# Altium project GRIPPER2009.PrjPcb (part 1 of 2)
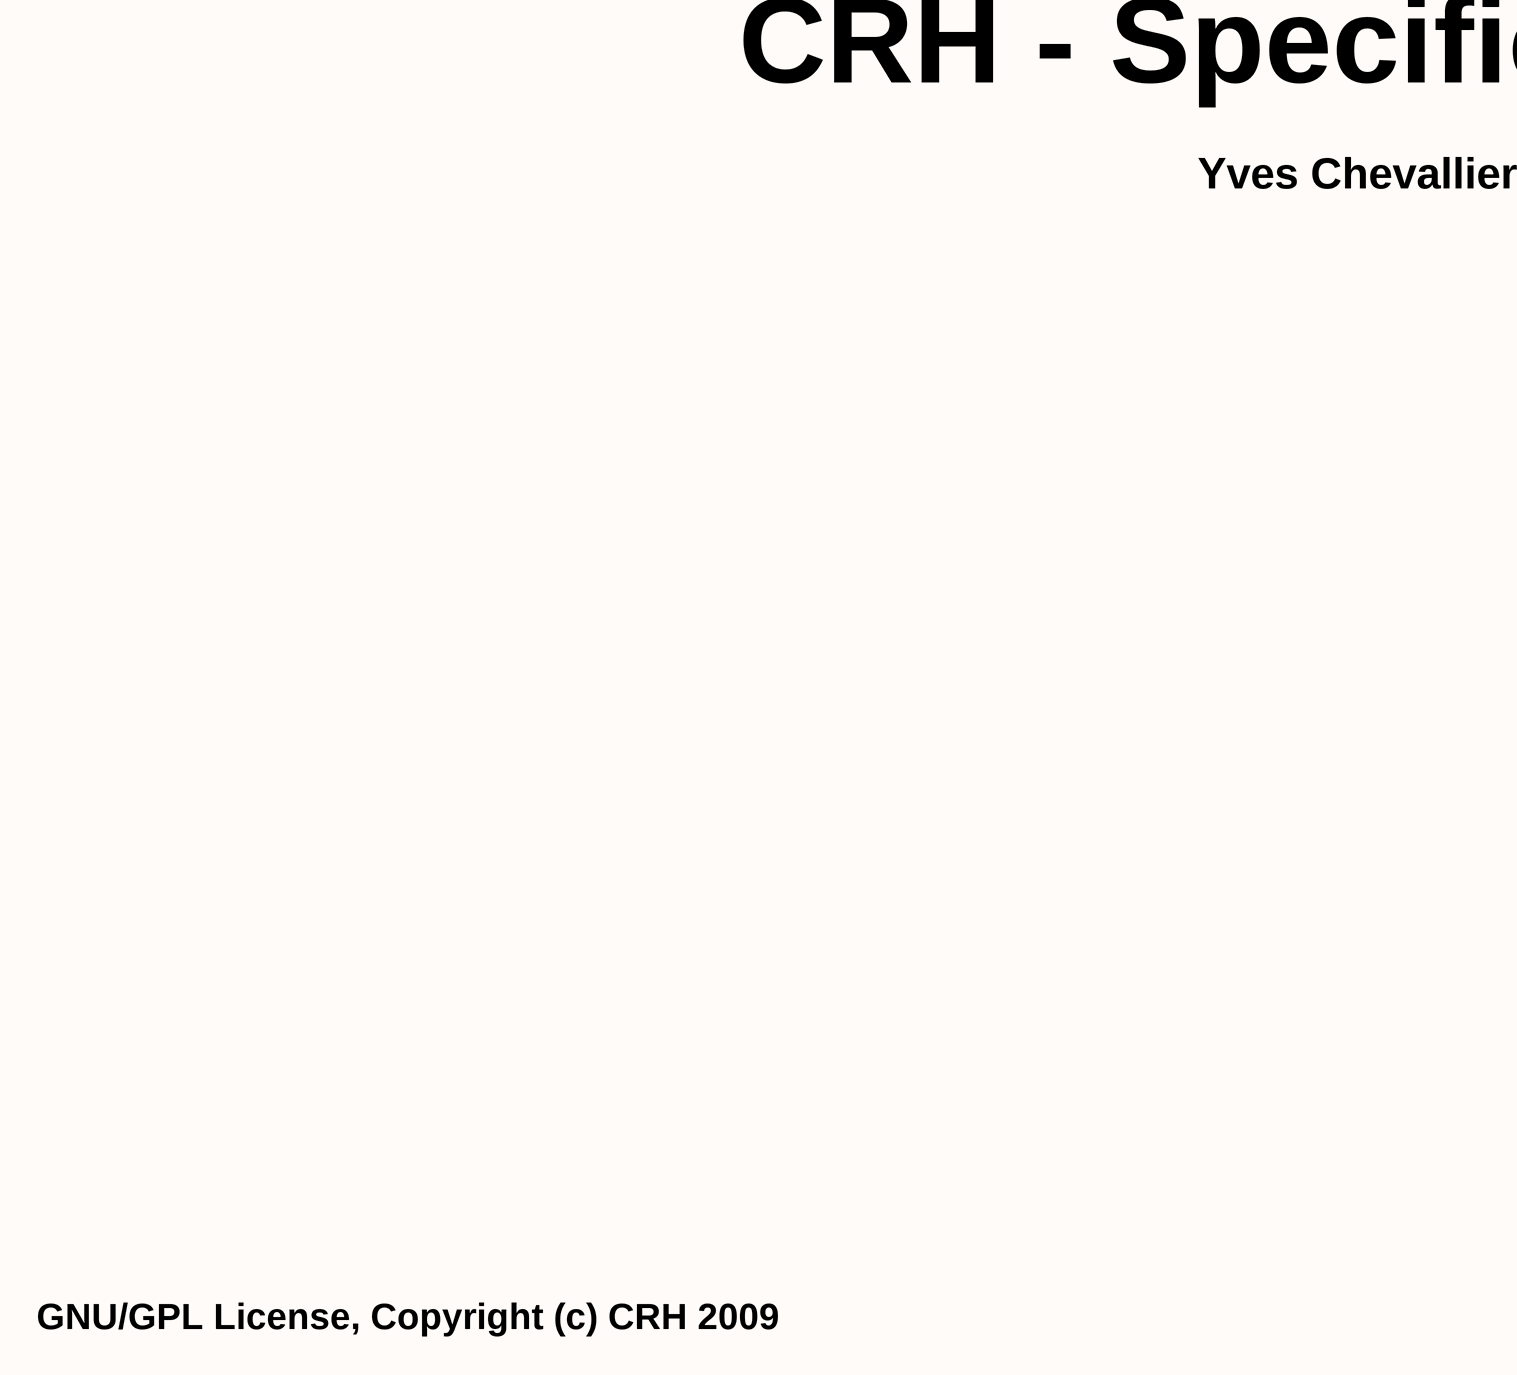
[diagram p0: 1.SchDoc, left]
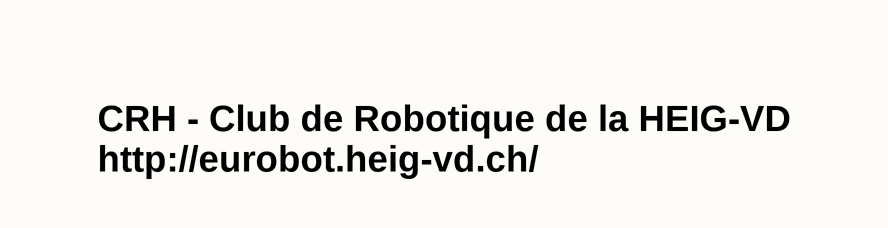
[diagram p1: 1.SchDoc, right]
5 sheets, 266 parts. Net scope: hierarchical (ports join the sheet entries above them; power ports are global).
Board file: GRIPPER2009.PcbDoc
Sheets:
  1.SchDoc
  2.SchDoc
  3.SchDoc
    TWO MOTORS = 5.SchDoc
      DRIVE1 = 4.SchDoc
      DRIVE = 4.SchDoc
    TWO MOTORS1 = 5.SchDoc
      DRIVE1 = 4.SchDoc
      DRIVE = 4.SchDoc

## Sheet 1.SchDoc
size 594 x 420 mm

### Notes on the sheet
- CRH - Specific board 2009
- Yves Chevallier - 31 Janvier 2009
- CRH - Club de Robotique de la HEIG-VD
  http://eurobot.heig-vd.ch/
- GNU/GPL License, Copyright (c) CRH 2009

## Sheet 2.SchDoc
size 420 x 297 mm
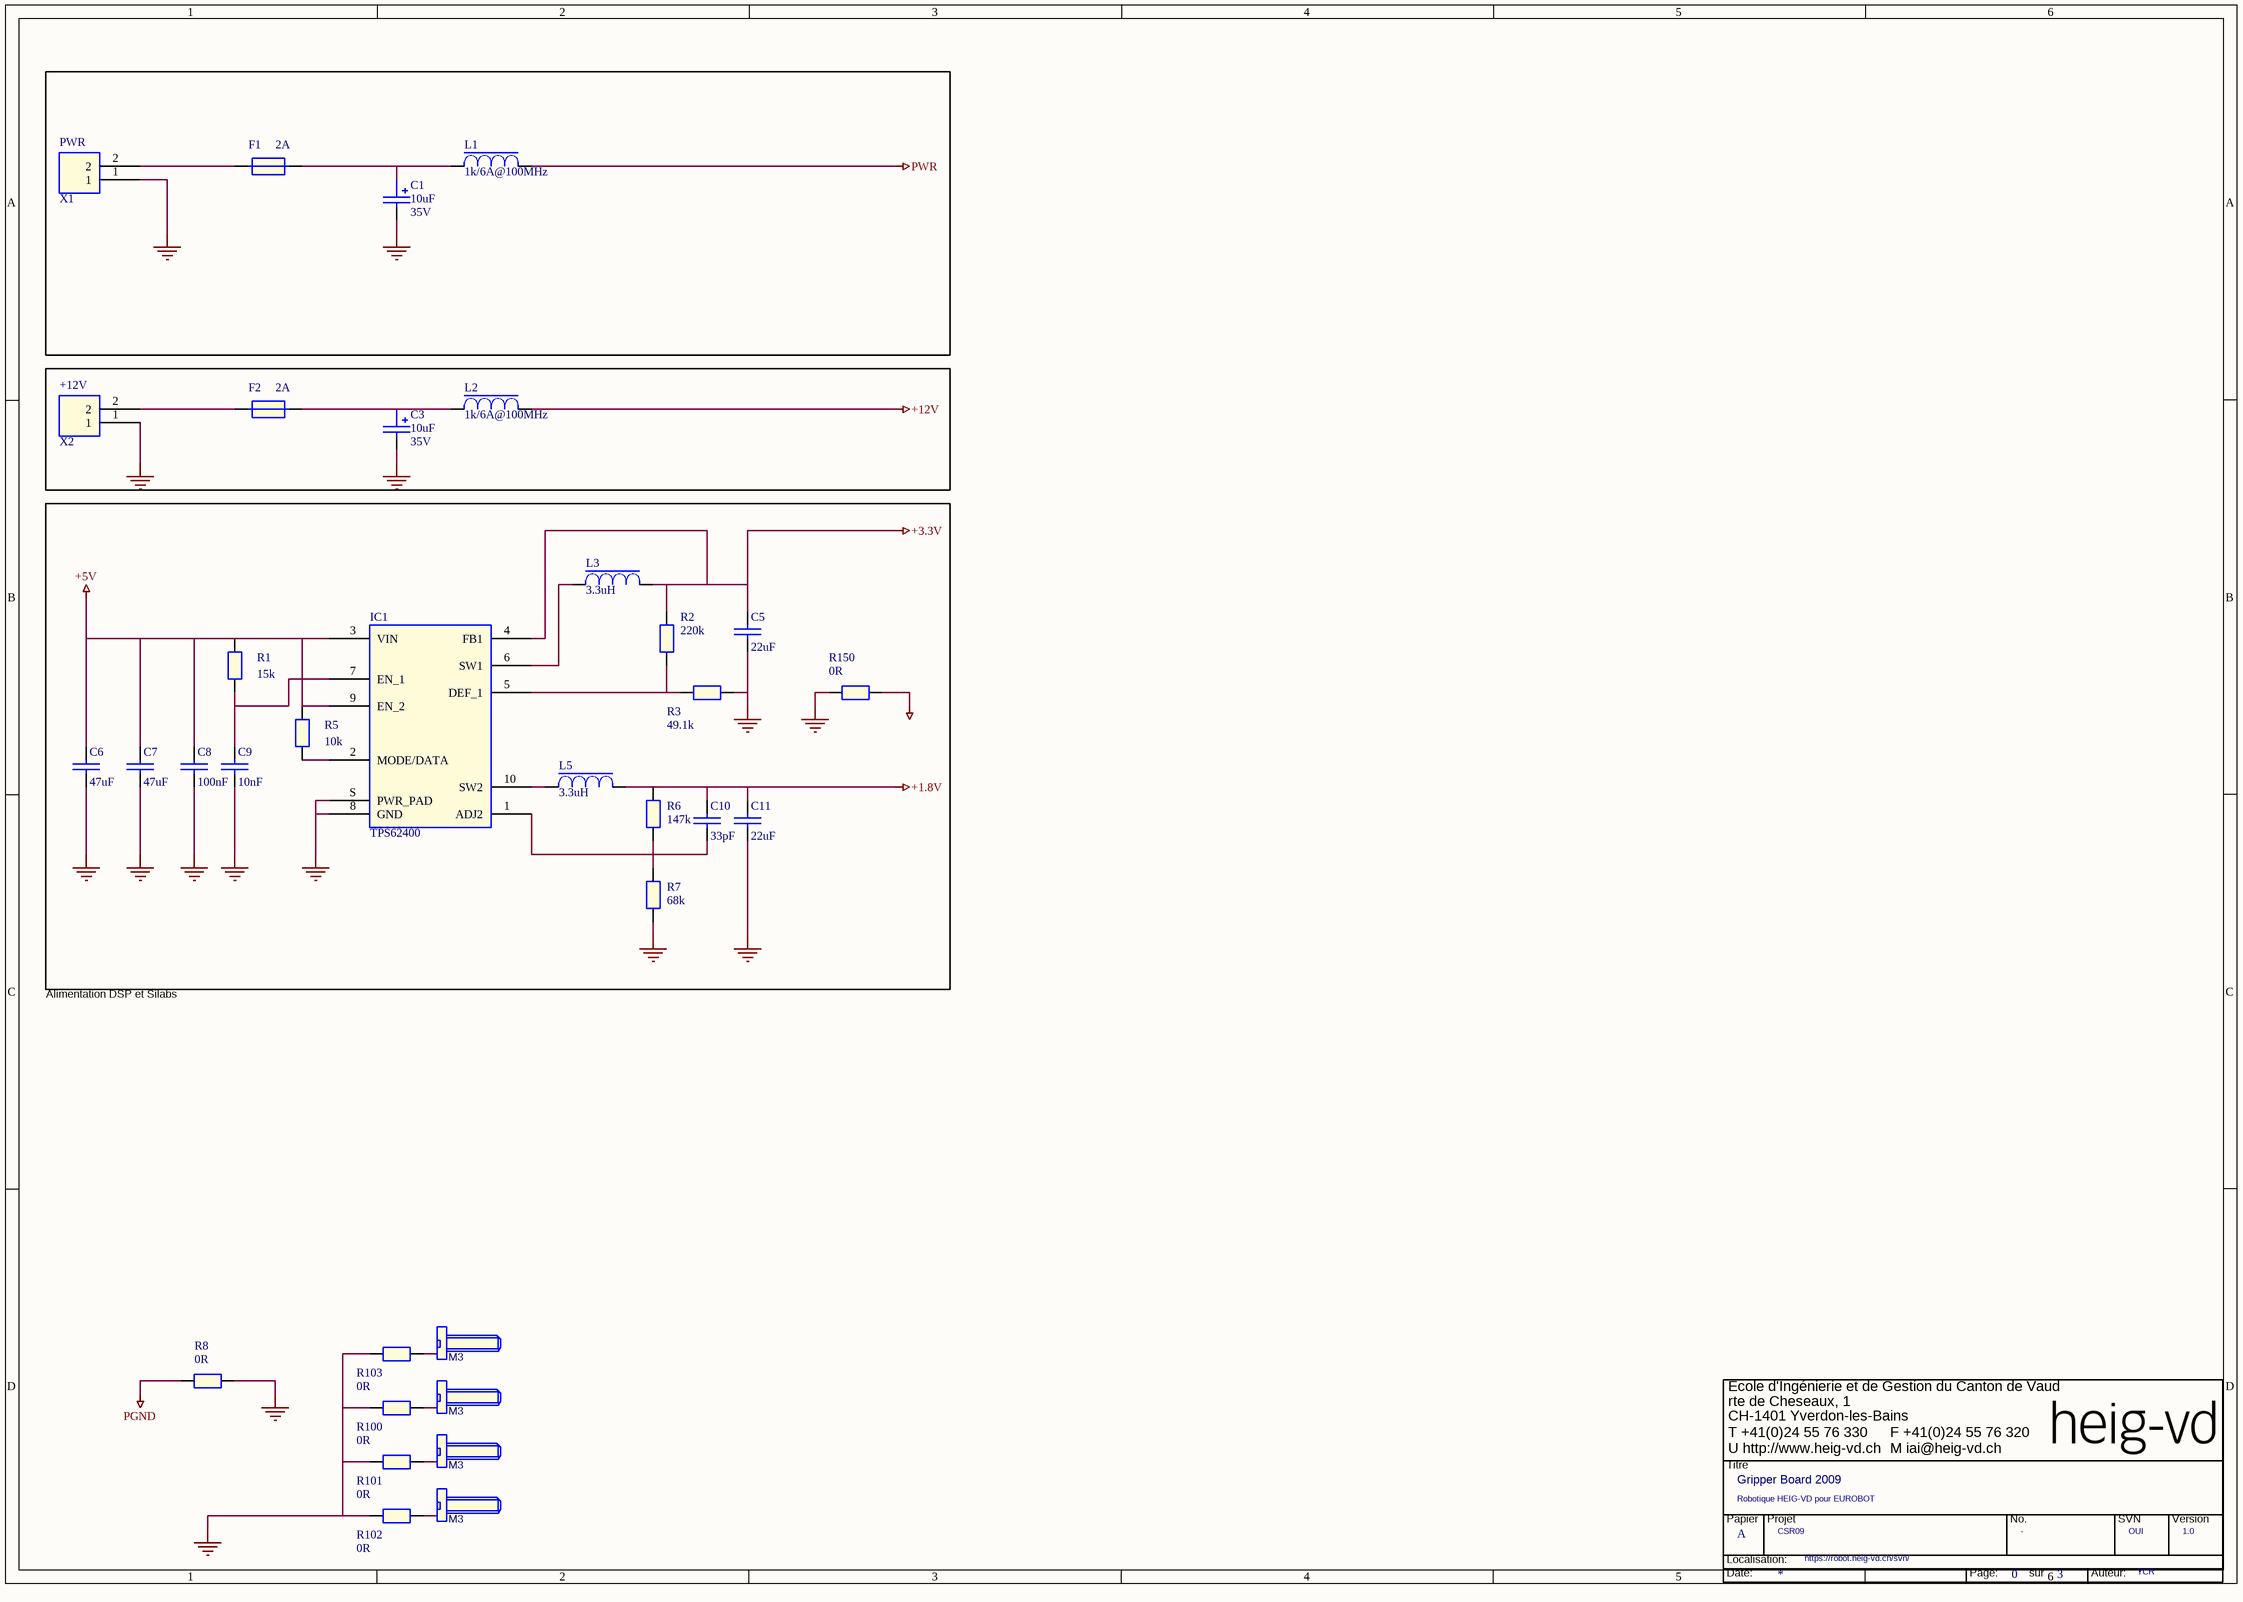
[diagram p2: 2.SchDoc]

### Parts
(Parts that share a designator on the sheet are numbered #1, #2 ... from top to bottom, then left to right.)
*#1  RevCode: 1.0  Title: Gripper Board 2009  Page Size: A  Page Number: 0  Page Count: 3  Projet: CSR09  Subtitle: Robotique HEIG-VD pour EUROBOT  Author: YCR  SVN: OUI  (hidden comment: TitleBlock HEIG-VD)  (graphical)
C1  10uF  Voltage: 35V  [SM/C_0805]
C3  10uF  Voltage: 35V  [SM/C_0805]
C5  22uF  [SM/C_0805]
C6  47uF  [SM/C_0805]
C7  47uF  [SM/C_0805]
C8  100nF  [SM/C_0805]
C9  10nF  [SM/C_0805]
C10  33pF  [SM/C_0805]
C11  22uF  [SM/C_0805]
F1  2A  [HEIG/LITTLEFUSE/NANO2]
F2  2A  [HEIG/LITTLEFUSE/NANO2]
H1  M3  [M3]  (value not drawn)
H2  M3  [M3]  (value not drawn)
H3  M3  [M3]  (value not drawn)
H4  M3  [M3]  (value not drawn)
IC1  TPS62400  [HEIG/TI/S-PVSON-N10]
L1  1k/6A@100MHz  [HEIG/SM/L_1210]
L2  1k/6A@100MHz  [HEIG/SM/L_1210]
L3  3.3uH  [HEIG/COILS/VLF4012A]
L5  3.3uH  [HEIG/COILS/VLF4012A]
R1  15k  [SM/R_0805]
R2  220k  [SM/R_0805]
R3  49.1k  [SM/R_0805]
R5  10k  [SM/R_0805]
R6  147k  [SM/R_0805]
R7  68k  [SM/R_0805]
R8  0R  [R400]
R100  0R  [SM/R_0805]
R101  0R  [SM/R_0805]
R102  0R  [SM/R_0805]
R103  0R  [SM/R_0805]
R150  0R  [SM/R_0805]
X1  PWR  [HEIG/PHOENIX/MC 1,5/ 2-G-3,81]
X2  +12V  [HEIG/PHOENIX/MC 1,5/ 2-G-3,81]

### Nets
+1.8V: C10.1 C11.1 L5.2 R6.2
+3.3V: C5.1 IC1.4(FB1) L3.2 R2.2
+5V: C6.1 C7.1 C8.1 IC1.3(VIN) IC1.9(EN_2) R1.2 R5.2
+12V: L2.2
AGND: R150.2
GND: C1.2 C3.2 C5.2 C6.2 C7.2 C8.2 C9.2 C11.2 IC1.8(GND) IC1.S(PWR_PAD) R3.2 R7.1 R8.2 R100.1 R101.1 R102.1 R103.1 R150.1 X1.1 X2.1
PGND: R8.1
PWR: L1.2
NetC1_1: C1.1 F1.2 L1.1
NetC3_1: C3.1 F2.2 L2.1
NetC9_1: C9.1 IC1.7(EN_1) R1.1
NetC10_2: C10.2 IC1.1(ADJ2) R6.1 R7.2
NetF1_1: F1.1 X1.2
NetF2_1: F2.1 X2.2
NetH1_1: H1.1(EARTH) R103.2
NetH2_1: H2.1(EARTH) R100.2
NetH3_1: H3.1(EARTH) R101.2
NetH4_1: H4.1(EARTH) R102.2
NetIC1_2: IC1.2(MODE/DATA) R5.1
NetIC1_5: IC1.5(DEF_1) R2.1 R3.1
NetIC1_6: IC1.6(SW1) L3.1
NetIC1_10: IC1.10(SW2) L5.1

### Notes on the sheet
- Alimentation DSP et Silabs
- (in symbol TitleBlock HEIG-VD) Ecole d'Ingénierie et de Gestion du Canton de Vaud; rte de Cheseaux, 1; CH-1401 Yverdon-les-Bains; T +41(0)24 55 76 330; F +41(0)24 55 76 320; U http://www.heig-vd.ch; M iai@heig-vd.ch; Titre; Papier; Projet; No.; SVN; Version; Localisation:; Date:; Page:; sur; Auteur:

### Library data of the parts
*#1 = TitleBlock HEIG-VD: OrgName: Yves Chevallier; OrgAddr1: Ecole d'Ingenierie et du Canton de Vaud; OrgAddr2: route de Cheseaux, 1; OrgAddr3: 1400 Yverdon-les-Bains; Page Create Date: March  8, 1995; No Projet: -; Location: https://robot.heig-vd.ch/svn/; Page Modify Date: *
C1 = C+: PCB Footprint: HEIG/SM/CT_7343; Prix: 2.85; Ref. Fabricant: AVX TPSD106K035R0125; Quantité min: 1; Fabricant: AVX; Ref. Distributeur: 1135215; Distributeur: Farnell; REF DISTRIBUTEUR: Footprint?; Manufacturer: AVX
C3 = C+: Manufacturer: AVX; PCB Footprint: HEIG/SM/CT_7343; Quantité min: 1; Ref. Fabricant: AVX TPSD106K035R0125; Prix: 2.85; Fabricant: AVX; REF DISTRIBUTEUR: Footprint?; Distributeur: Farnell; Ref. Distributeur: 1135215
C5 = C_Dup1: Quantité min: 1; Fabricant: AVX; Ref. Fab: AVXMCCTA106M006.MULTICOMP; VOLTAGE: 6.3V; Référence: 757-720; Prix Unitaire: 0.40; Prix: 1.15; Ref. Fabricant: C1206C226K9PAC; PCB Footprint: HEIG/SM/C_1206; Price in €: 0.87; Ref. Distributor: 967-014; Distributor: Farnell; Ref. Distributeur: 1288265; Distributeur: Farnell
C6 C7 = C_Dup1: Quantité min: 1; Fabricant: AVX; Ref. Fabricant: 12106D476MAT2A; Prix: 8.20; Ref. Fab: AVXMCCTA106M006.MULTICOMP; VOLTAGE: 6.3V; Référence: 757-720; Prix Unitaire: 0.40; PCB Footprint: HEIG/SM/C_1206; Ref. Distributeur: 1327743; Distributeur: Farnell; Price in €: 0.87; Ref. Distributor: 967-014; Distributor: Farnell
C8-C10 = C_Dup1: PCB Footprint: HEIG/SM/C_0603; Quantité min: 1; Ref. Fab: AVXMCCTA106M006.MULTICOMP; VOLTAGE: 10V; Référence: 757-720; Prix Unitaire: 0.40; Distributeur: Farnell; Price in €: 0.87; Ref. Distributor: 967-014; Distributor: Farnell
C11 = C_Dup1: Quantité min: 1; Fabricant: AVX; Ref. Fabricant: C1206C226K9PAC; Prix: 1.15; Ref. Fab: AVXMCCTA106M006.MULTICOMP; VOLTAGE: 6.3V; Référence: 757-720; Prix Unitaire: 0.40; PCB Footprint: HEIG/SM/C_1206; Ref. Distributeur: 1288265; Distributeur: Farnell; Price in €: 0.87; Ref. Distributor: 967-014; Distributor: Farnell
F1 = Fusible: Fabricant: LITTELFUSE; Ref. Fabricant: 0461002T; Prix: 2.65; Voltage: 60V; Quantité min: 1; PCB Footprint: HEIG/LITTLEFUSE/NANO2; Ref. Distributeur: 1651770; Distributeur: Farnell
F2 = Fusible: Fabricant: LITTELFUSE; Ref. Fabricant: 0461002T; Prix: 2.65; Voltage: 600V; Quantité min: 1; PCB Footprint: HEIG/LITTLEFUSE/NANO2; Ref. Distributeur: 1651770; Distributeur: Farnell
H1-H4 = M3: PCB Footprint: HEIG/HOLE/M3
IC1 = TPS62400_1: Fabricant: TEXAS INSTRUMENTS; Ref. Fabricant: TPS62400DRCTG4; Prix: 11.25; Quantité min: 1; PCB Footprint: HEIG/TI/S-PVSON-N10; Ref. Distributeur: 1329597; Distributeur: Farnell
L1 L2 = L Noyau: Manufacturer: EPCOS; Prix: 0.51; Ref. Fabricant: FBMH3225HM102NT; Quantité min: 1; Fabricant: TAIYO YUDEN; Distributeur: Farnell; Ref. Distributeur: 1651731; REF DISTRIBUTEUR: Footprint?; PCB Footprint: HEIG/SM/L_1210
L3 L5 = L Noyau: Prix: 3.90; Ref. Fabricant: VLF4012AT-3R3M1R3; Fabricant: TDK; Quantité min: 1; Ref. Distributeur: 1301686; Distributeur: Farnell; PCB Footprint: HEIG/COILS/VLF4012A
R1 R2 R5 = R SMD 0805N: PCB Footprint: HEIG/SM/R_0603; Quantité min: 50; Prix: 0.064; Package: SMD 0805N; Distributeur: Farnell
R3 = R SMD 0805N: PCB Footprint: HEIG/SM/R_0603; Prix: 0.064; Quantité min: 50; Package: SMD 0805N; Distributeur: Farnell
R6 = R SMD 0805N: PCB Footprint: HEIG/SM/R_0603; Quantité min: 50; Fabricant: MULTICOMP; Ref. Fabricant: MC 0.063W 0603 1% 147K; Prix: 0.064; Package: SMD 0805N; Ref. Distributeur: 1171002; Distributeur: Farnell
R7 = R SMD 0805N: PCB Footprint: HEIG/SM/R_0603; Quantité min: 50; Fabricant: MULTICOMP; Ref. Fabricant: MC 0.063W 0603 5% 68K; Prix: 0.064; Package: SMD 0805N; Ref. Distributeur: 9332278; Distributeur: Farnell
R8 = R_Dup3: PCB Footprint: HEIG/SM/R_0805; Ref. Fabricant: MC 0.063W 0603 1% 10K; Prix: 0.06; Quantité min: 50; Fabricant: MULTICOMP; Ref. Distributeur: 9330399; Distributeur: Farnell
R100-R103 = R SMD 0805N: Prix: 0.064; Quantité min: 50; PCB Footprint: HEIG/SM/R_0805; Package: SMD 0805N; Distributeur: Farnell
R150 = R SMD 0805N: Prix: 0.064; Quantité min: 50; PCB Footprint: HEIG/SM/R_0603; Package: SMD 0805N; Distributeur: Farnell
X1 X2 = Connecteur 02: PCB Footprint: HEIG/PHOENIX/MC 1,5/ 2-G-3,81

## Sheet 3.SchDoc
size 420 x 297 mm
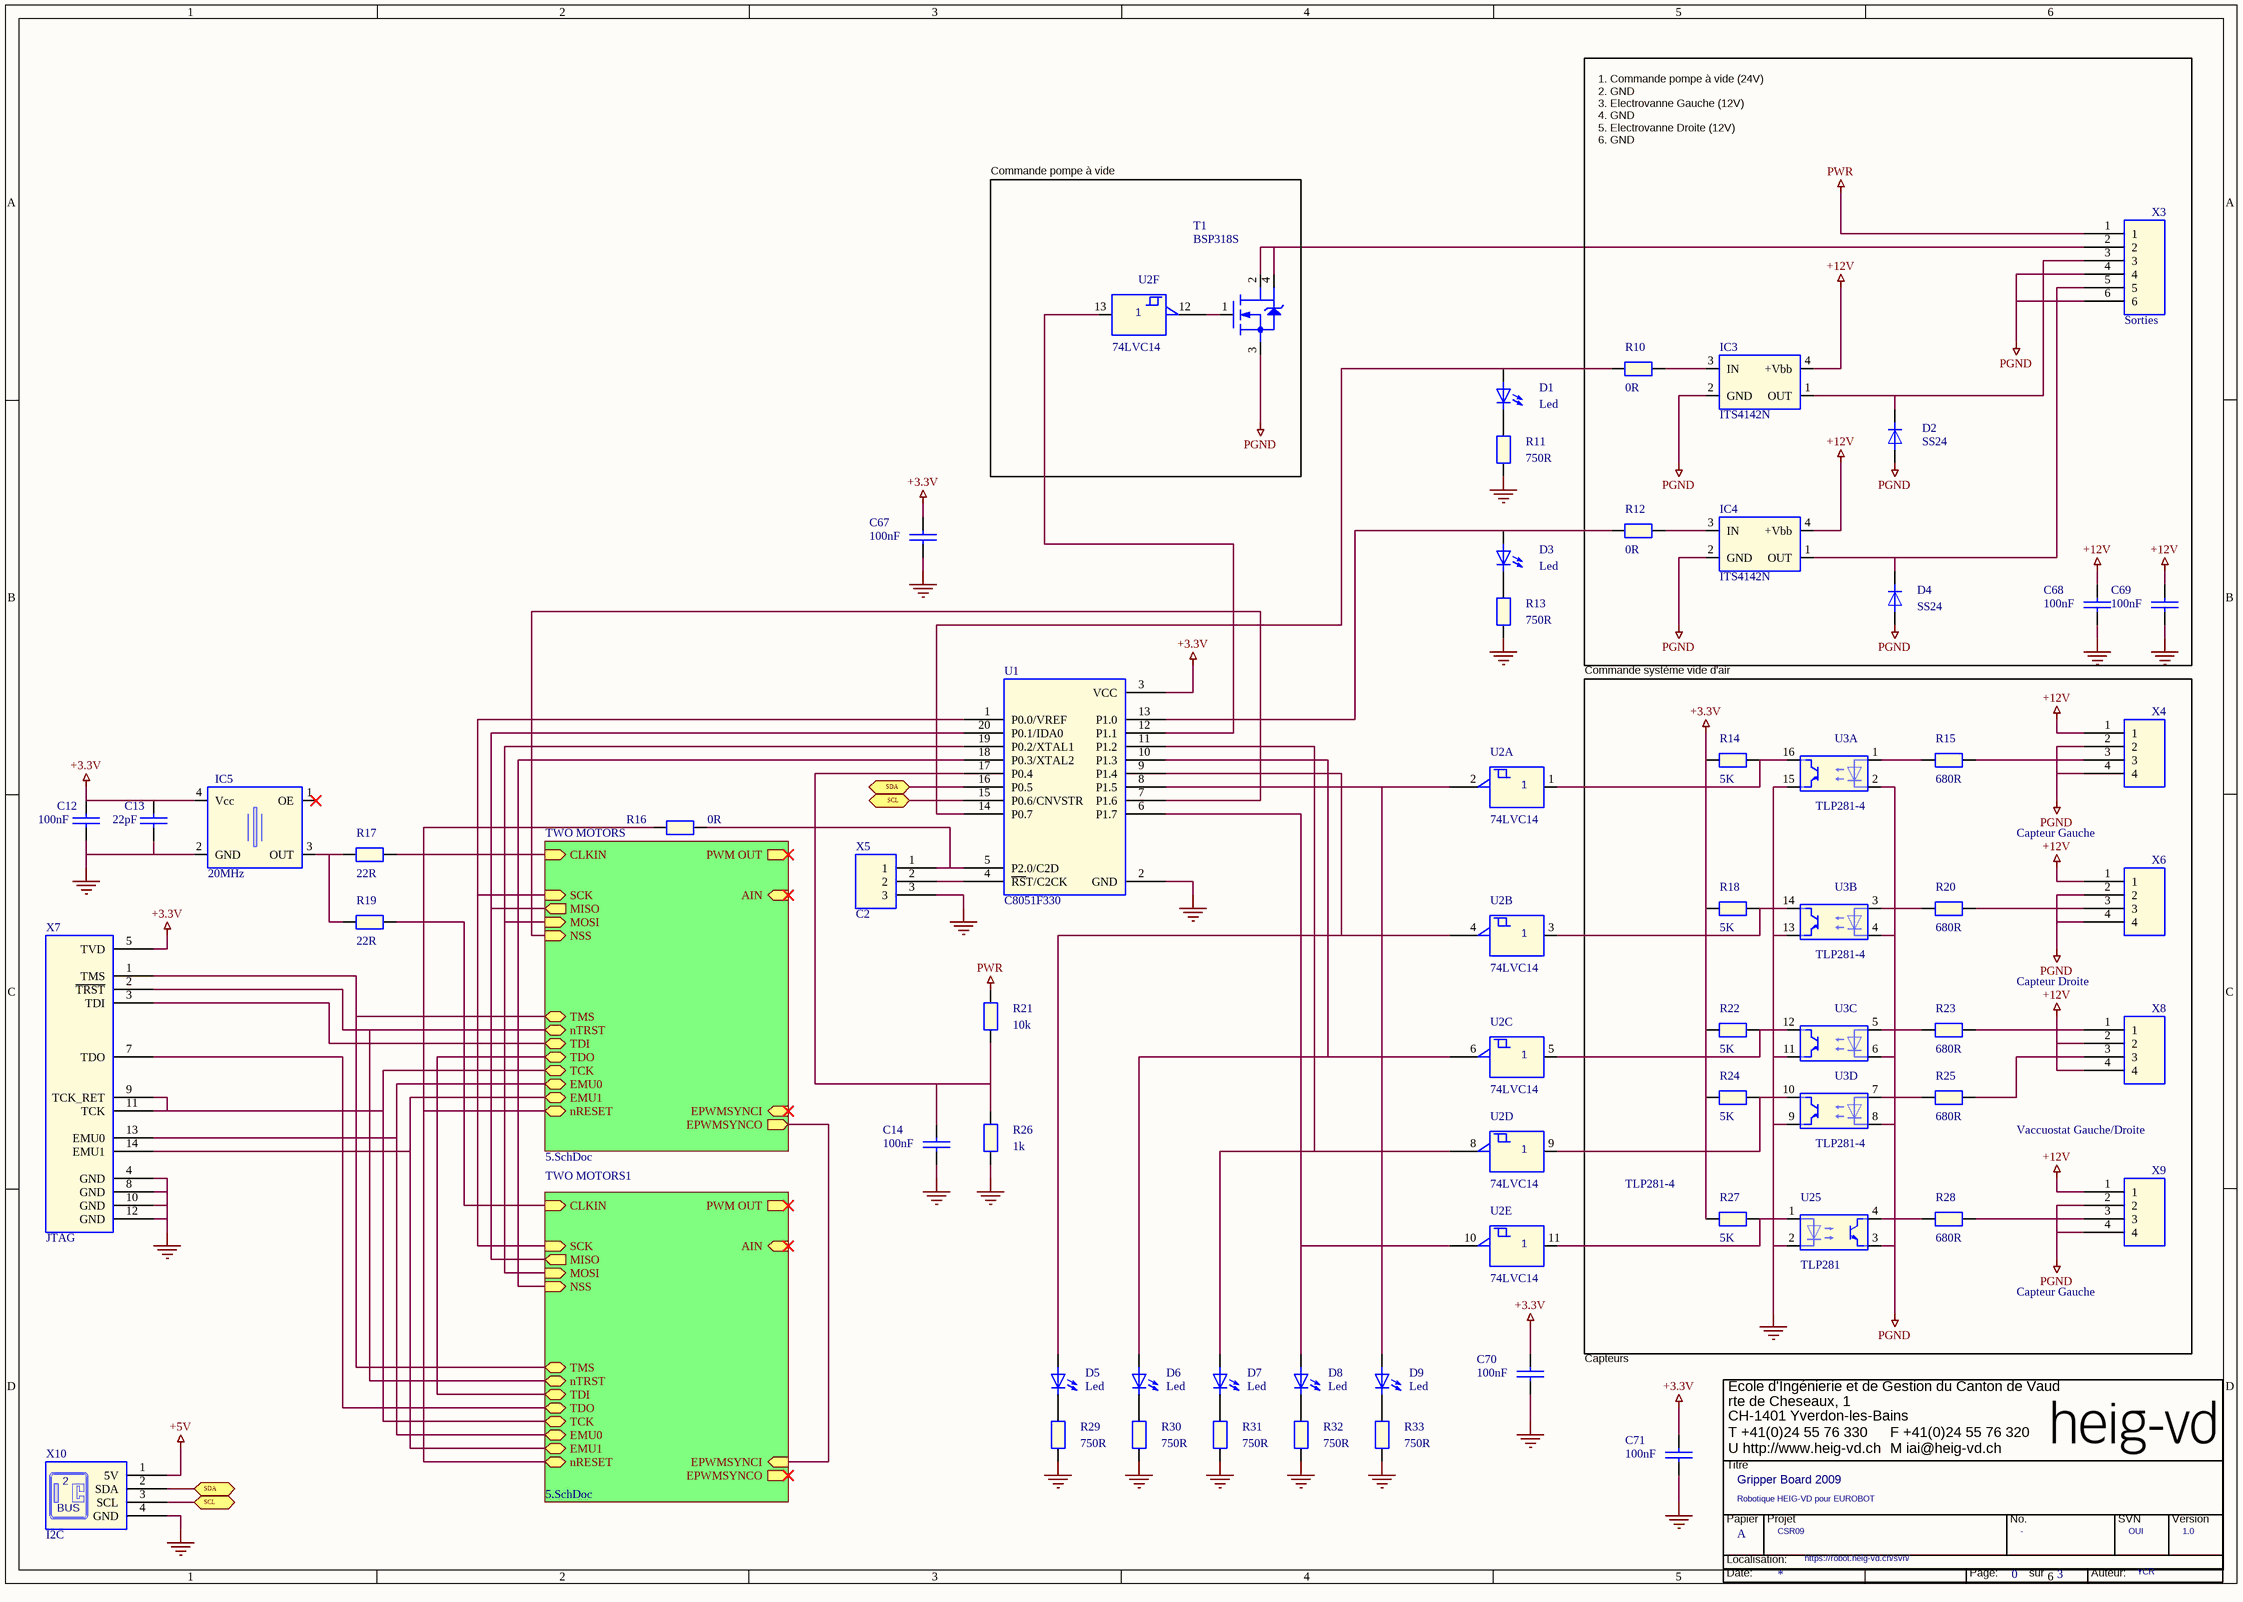
[diagram p3: 3.SchDoc]

### Parts
(Parts that share a designator on the sheet are numbered #1, #2 ... from top to bottom, then left to right.)
*#2  RevCode: 1.0  Title: Gripper Board 2009  Page Size: A  Page Number: 0  Page Count: 3  Projet: CSR09  Subtitle: Robotique HEIG-VD pour EUROBOT  Author: YCR  SVN: OUI  (hidden comment: TitleBlock HEIG-VD)  (graphical)
C12  100nF  [SM/C_0805]
C13  22pF  [SM/C_0805]
C14  100nF  [SM/C_0805]
C67  100nF  [SM/C_0805]
C68  100nF  [SM/C_0805]
C69  100nF  [SM/C_0805]
C70  100nF  [SM/C_0805]
C71  100nF  [SM/C_0805]
D1  Led  [LED 5]
D2  SS24  [HEIG/SM/DO214]
D3  Led  [LED 5]
D4  SS24  [HEIG/SM/DO214]
D5  Led  [LED 5]
D6  Led  [LED 5]
D7  Led  [LED 5]
D8  Led  [LED 5]
D9  Led  [LED 5]
IC3  ITS4142N  [HEIG/SM/SOT223]
IC4  ITS4142N  [HEIG/SM/SOT223]
IC5  20MHz  [HEIG/OSC/SPX0/SG-310]
R10  0R  [R400]
R11  750R  [R400]
R12  0R  [R400]
R13  750R  [R400]
R14  5K  [R400]
R15  680R  [R400]
R16  0R  [R400]
R17  22R  [R400]
R18  5K  [R400]
R19  22R  [R400]
R20  680R  [R400]
R21  10k  [R400]
R22  5K  [R400]
R23  680R  [R400]
R24  5K  [R400]
R25  680R  [R400]
R26  1k  [R400]
R27  5K  [R400]
R28  680R  [R400]
R29  750R  [R400]
R30  750R  [R400]
R31  750R  [R400]
R32  750R  [R400]
R33  750R  [R400]
T1  BSP318S  [HEIG/SM/SOT223]
U1  C8051F330  [F300]
U2#1  74LVC14  [HEIG/SM/SOIC14]  (part F of 6)
U2#2  74LVC14  [HEIG/SM/SOIC14]  (part A of 6)
U2#3  74LVC14  [HEIG/SM/SOIC14]  (part B of 6)
U2#4  74LVC14  [HEIG/SM/SOIC14]  (part C of 6)
U2#5  74LVC14  [HEIG/SM/SOIC14]  (part D of 6)
U2#6  74LVC14  [HEIG/SM/SOIC14]  (part E of 6)
U3  TLP281-4  [HEIG/SM/SOIC16/7.0M]  (parts A,B,C,D of 4)
U25  TLP281  [HEIG/SM/SOIC04/7.0M]
X3  Sorties  [HEIG/WAGO/733-336]
X4  Capteur Gauche  [HEIG/WAGO/733-334]
X5  C2  [HEIG/CON/INLINE03]
X6  Capteur Droite  [HEIG/WAGO/733-334]
X7  JTAG  [HEIG/CON/INLINE14/2]
X8  Vaccuostat Gauche/Droite  [HEIG/WAGO/733-334]
X9  Capteur Gauche  [HEIG/WAGO/733-334]
X10  I2C  [HEIG/CON/MICROMATCH/4F]

### Blocks framed on the sheet
Commande pompe à vide: T1 U2#1
Commande système vide d'air: R14 R15 R18 R20 R22-R25 R27 R28 U3 U25 X4 X6 X8 X9

### Sub-sheets
TWO MOTORS = 5.SchDoc: MOSI (in), NSS (in), SCK (in), MISO (out), TMS (bidir), nTRST (bidir), TDI (bidir), TDO (bidir), TCK (bidir), EMU0 (bidir), EMU1 (bidir), nRESET (bidir), CLKIN (in), EPWMSYNCO (out), EPWMSYNCI (in), AIN (in), PWM OUT (out)  | ReuseAnnotated: YES; U__2_PartReference: U22; R494_PartReference: R67; C__7_PartReference: C53; U__3_PartReference: IC8; WARNING1_PartReference: WARNING3; C__8_PartReference: C54; C__2_PartReference: C55; U__4_PartReference: IC8; U7_1_PartReference: U7; R__11_PartReference: R68; D__PartReference: D12; U24_PartReference: U7; C__18_PartReference: C56; C__PartReference: C57; Q__1_PartReference: Q3; C__1_PartReference: C58; DRIVE_X__PartReference: X15; DRIVE_C__15_PartReference: C47; DRIVE_U__9_PartReference: U19; DRIVE_C__13_PartReference: C48; DRIVE_C__16_PartReference: C49; DRIVE_R__10_PartReference: R87; DRIVE_C__17_PartReference: C51; DRIVE_C__20_PartReference: C77; DRIVE_R__6_PartReference: R62; DRIVE_R__9_PartReference: R86; DRIVE_U6_PartReference: U20; DRIVE_R__4_PartReference: R63; DRIVE_C__14_PartReference: C52; DRIVE_R__8_PartReference: R64; DRIVE_R__7_PartReference: R65; DRIVE_U__8_PartReference: U21; DRIVE_R__5_PartReference: R66; DRIVE_TitleBlock_3_Page_Number: 0; R497_PartReference: R69; Q__PartReference: Q4; R__PartReference: R70; X29_PartReference: X16; R493_PartReference: R71; C__4_PartReference: C59; C__3_PartReference: C60; U__5_PartReference: IC8; C__10_PartReference: C61; U__1_PartReference: IC8; U__6_PartReference: IC8; R495_PartReference: R72; C__19_PartReference: C79; D__1_PartReference: D13; R499_PartReference: R73; U7_2_PartReference: U7; C__5_PartReference: C62; C__6_PartReference: C63; U7_PartReference: U7; R496_PartReference: R74; C__11_PartReference: C64; R__1_PartReference: R75; U__7_PartReference: IC8; C__12_PartReference: C65; R492_PartReference: R76; DRIVE1_X__PartReference: X14; DRIVE1_C__15_PartReference: C41; DRIVE1_U__9_PartReference: U16; DRIVE1_C__13_PartReference: C42; DRIVE1_C__16_PartReference: C43; DRIVE1_R__10_PartReference: R85; DRIVE1_C__17_PartReference: C45; DRIVE1_C__20_PartReference: C76; DRIVE1_R__6_PartReference: R57; DRIVE1_R__9_PartReference: R84; DRIVE1_U6_PartReference: U17; DRIVE1_R__4_PartReference: R58; DRIVE1_C__14_PartReference: C46; DRIVE1_R__8_PartReference: R59; DRIVE1_R__7_PartReference: R60; DRIVE1_U__8_PartReference: U18; DRIVE1_R__5_PartReference: R61; DRIVE1_TitleBlock_3_Page_Number: 0; R__2_PartReference: R77; C__21_PartReference: C78; R__3_PartReference: R78; C__9_PartReference: C66; U__PartReference: U22; R498_PartReference: R79; TitleBlock_Page_Number: 0
TWO MOTORS1 = 5.SchDoc: MOSI (in), NSS (in), SCK (in), MISO (out), TMS (bidir), nTRST (bidir), TDI (bidir), TDO (bidir), TCK (bidir), EMU0 (bidir), EMU1 (bidir), nRESET (bidir), CLKIN (in), EPWMSYNCI (in), EPWMSYNCO (out), AIN (in), PWM OUT (out)  | ReuseAnnotated: YES; U__2_PartReference: U14; R494_PartReference: R53; C__7_PartReference: C34; U__3_PartReference: IC7; WARNING1_PartReference: WARNING2; C__8_PartReference: C27; C__2_PartReference: C33; U__4_PartReference: IC7; U7_1_PartReference: U24; R__11_PartReference: R45; D__PartReference: D10; U24_PartReference: U24; C__18_PartReference: C28; C__PartReference: C36; Q__1_PartReference: Q2; C__1_PartReference: C37; DRIVE_X__PartReference: X12; DRIVE_C__15_PartReference: C21; DRIVE_U__9_PartReference: U11; DRIVE_C__13_PartReference: C22; DRIVE_C__16_PartReference: C23; DRIVE_R__10_PartReference: R83; DRIVE_C__17_PartReference: C25; DRIVE_C__20_PartReference: C73; DRIVE_R__6_PartReference: R39; DRIVE_R__9_PartReference: R82; DRIVE_U6_PartReference: U12; DRIVE_R__4_PartReference: R40; DRIVE_C__14_PartReference: C26; DRIVE_R__8_PartReference: R41; DRIVE_R__7_PartReference: R42; DRIVE_U__8_PartReference: U13; DRIVE_R__5_PartReference: R43; DRIVE_TitleBlock_3_Page_Number: 0; R497_PartReference: R47; Q__PartReference: Q1; R__PartReference: R55; X29_PartReference: X13; R493_PartReference: R52; C__4_PartReference: C32; C__3_PartReference: C35; U__5_PartReference: IC7; C__10_PartReference: C39; U__1_PartReference: IC7; U__6_PartReference: IC7; R495_PartReference: R54; C__19_PartReference: C75; D__1_PartReference: D11; R499_PartReference: R49; U7_2_PartReference: U24; C__5_PartReference: C30; C__6_PartReference: C31; U7_PartReference: U24; R496_PartReference: R46; C__11_PartReference: C38; R__1_PartReference: R44; U__7_PartReference: IC7; C__12_PartReference: C29; R492_PartReference: R50; DRIVE1_X__PartReference: X11; DRIVE1_C__15_PartReference: C16; DRIVE1_U__9_PartReference: U9; DRIVE1_C__13_PartReference: C20; DRIVE1_C__16_PartReference: C18; DRIVE1_R__10_PartReference: R81; DRIVE1_C__17_PartReference: C17; DRIVE1_C__20_PartReference: C72; DRIVE1_R__6_PartReference: R35; DRIVE1_R__9_PartReference: R80; DRIVE1_U6_PartReference: U8; DRIVE1_R__4_PartReference: R34; DRIVE1_C__14_PartReference: C15; DRIVE1_R__8_PartReference: R37; DRIVE1_R__7_PartReference: R38; DRIVE1_U__8_PartReference: U10; DRIVE1_R__5_PartReference: R36; DRIVE1_TitleBlock_3_Page_Number: 1; R__2_PartReference: R51; C__21_PartReference: C74; R__3_PartReference: R56; C__9_PartReference: C40; U__PartReference: U14; R498_PartReference: R48; TitleBlock_Page_Number: 1

### Ports
SCL (bidir), SDA (bidir)

### Nets
+3.3V: C12.1 C13.1 C67.1 C70.1 C71.1 IC5.4(Vcc) R14.1 R18.1 R22.1 R24.1 R27.1 U1.3(VCC) X7.5(TVD)
+5V: U2#1.14(+5V) U2#2.14(+5V) U2#3.14(+5V) U2#4.14(+5V) U2#5.14(+5V) U2#6.14(+5V) X10.1(5V)
+12V: C68.1 C69.1 IC3.4(+Vbb) IC4.4(+Vbb) X4.1 X6.1 X8.2 X8.4 X9.1
GND: C12.2 C13.2 C14.2 C67.2 C68.2 C69.2 C70.2 C71.2 IC5.2(GND) R11.1 R13.1 R26.1 R29.1 R30.1 R31.1 R32.1 R33.1 U1.2(GND) U2#1.7(GND) U2#2.7(GND) U2#3.7(GND) U2#4.7(GND) U2#5.7(GND) U2#6.7(GND) U3.9(E) U3.11(E) U3.13(E) U3.15(E) U25.2(C) X5.3 X7.4(GND) X7.8(GND) X7.10(GND) X7.12(GND) X10.4(GND)
PGND: D2.1(a) D4.1(a) IC3.2(GND) IC4.2(GND) T1.3(S) U3.2(C) U3.4(C) U3.6(C) U3.8(C) U25.3(E) X3.4 X3.6 X4.2 X4.4 X6.2 X6.4 X9.2 X9.4
PWR: R21.2 X3.1
Net=U__PartReference_TWO_MOTORS1_57: U1.18(P0.3/XTAL2) ; sheet TWO MOTORS1/NSS
Net=U__PartReference_TWO_MOTORS1_76: X7.7(TDO) ; sheet TWO MOTORS1/TDO
Net=U__PartReference_TWO_MOTORS1_90: R19.2 ; sheet TWO MOTORS1/CLKIN
Net=U__PartReference_TWO_MOTORS_5: sheet TWO MOTORS/EPWMSYNCO, sheet TWO MOTORS1/EPWMSYNCI
Net=U__PartReference_TWO_MOTORS_50: U1.19(P0.2/XTAL1) ; sheet TWO MOTORS/MOSI, sheet TWO MOTORS1/MOSI
Net=U__PartReference_TWO_MOTORS_52: U1.20(P0.1/IDA0) ; sheet TWO MOTORS/MISO, sheet TWO MOTORS1/MISO
Net=U__PartReference_TWO_MOTORS_54: U1.1(P0.0/VREF) ; sheet TWO MOTORS/SCK, sheet TWO MOTORS1/SCK
Net=U__PartReference_TWO_MOTORS_57: U1.7(P1.6) ; sheet TWO MOTORS/NSS
Net=U__PartReference_TWO_MOTORS_73: X7.3(TDI) ; sheet TWO MOTORS/TDI
Net=U__PartReference_TWO_MOTORS_74: X7.1(TMS) ; sheet TWO MOTORS/TMS, sheet TWO MOTORS1/TMS
Net=U__PartReference_TWO_MOTORS_75: X7.9(TCK_RET) X7.11(TCK) ; sheet TWO MOTORS/TCK, sheet TWO MOTORS1/TCK
Net=U__PartReference_TWO_MOTORS_76: sheet TWO MOTORS/TDO, sheet TWO MOTORS1/TDI
Net=U__PartReference_TWO_MOTORS_78: R16.1 ; sheet TWO MOTORS/nRESET, sheet TWO MOTORS1/nRESET
Net=U__PartReference_TWO_MOTORS_80: X7.13(EMU0) ; sheet TWO MOTORS/EMU0, sheet TWO MOTORS1/EMU0
Net=U__PartReference_TWO_MOTORS_81: X7.14(EMU1) ; sheet TWO MOTORS/EMU1, sheet TWO MOTORS1/EMU1
Net=U__PartReference_TWO_MOTORS_84: X7.2(~{TRST}) ; sheet TWO MOTORS/nTRST, sheet TWO MOTORS1/nTRST
Net=U__PartReference_TWO_MOTORS_90: R17.2 ; sheet TWO MOTORS/CLKIN
NetC14_1: C14.1 R21.1 R26.2 U1.17(P0.4)
NetD1_1: D1.1 R10.1 U1.14(P0.7)
NetD1_2: D1.2 R11.2
NetD2_2: D2.2(k) IC3.1(OUT) X3.3
NetD3_1: D3.1 R12.1 U1.13(P1.0)
NetD3_2: D3.2 R13.2
NetD4_2: D4.2(k) IC4.1(OUT) X3.5
NetD5_1: D5.1 U1.9(P1.4) U2#3.4(6Y)
NetD5_2: D5.2 R29.2
NetD6_1: D6.1 U1.10(P1.3) U2#4.6(6Y)
NetD6_2: D6.2 R30.2
NetD7_1: D7.1 U1.11(P1.2) U2#5.8(6Y)
NetD7_2: D7.2 R31.2
NetD8_1: D8.1 U1.6(P1.7) U2#6.10(6Y)
NetD8_2: D8.2 R32.2
NetD9_1: D9.1 U1.8(P1.5) U2#2.2(6Y)
NetD9_2: D9.2 R33.2
NetIC3_3: IC3.3(IN) R10.2
NetIC4_3: IC4.3(IN) R12.2
NetIC5_3: IC5.3(OUT) R17.1 R19.1
NetR14_2: R14.2 U2#2.1(6A) U3.16(COL)
NetR15_1: R15.1 U3.1(A)
NetR15_2: R15.2 X4.3
NetR16_2: R16.2 U1.5(P2.0/C2D) X5.1
NetR18_2: R18.2 U2#3.3(6A) U3.14(COL)
NetR20_1: R20.1 U3.3(A)
NetR20_2: R20.2 X6.3
NetR22_2: R22.2 U2#4.5(6A) U3.12(COL)
NetR23_1: R23.1 U3.5(A)
NetR23_2: R23.2 X8.1
NetR24_2: R24.2 U2#5.9(6A) U3.10(COL)
NetR25_1: R25.1 U3.7(A)
NetR25_2: R25.2 X8.3
NetR27_2: R27.2 U2#6.11(6A) U25.1(A)
NetR28_1: R28.1 U25.4(COL)
NetR28_2: R28.2 X9.3
NetT1_1: T1.1(G) U2#1.12(6Y)
NetT1_2: T1.2(D) T1.4(D) X3.2
NetU1_4: U1.4(~{RS}T/C2CK) X5.2
NetU1_12: U1.12(P1.1) U2#1.13(6A)
NetU1_15: U1.15(P0.6/CNVSTR) X10.3(SCL) ; port SCL
NetU1_16: U1.16(P0.5) X10.2(SDA) ; port SDA

Not connected (* = marked no-connect by the designer): IC5 1(OE)*

### Notes on the sheet
- 1. Commande pompe à vide (24V)
  2. GND
  3. Electrovanne Gauche (12V)
  4. GND
  5. Electrovanne Droite (12V)
  6. GND
- Capteurs
- (in symbol I2C) BUS
- (in symbol TitleBlock HEIG-VD) Ecole d'Ingénierie et de Gestion du Canton de Vaud; rte de Cheseaux, 1; CH-1401 Yverdon-les-Bains; T +41(0)24 55 76 330; F +41(0)24 55 76 320; U http://www.heig-vd.ch; M iai@heig-vd.ch; Titre; Papier; Projet; No.; SVN; Version; Localisation:; Date:; Page:; sur; Auteur:

### Library data of the parts
*#2 = TitleBlock HEIG-VD: as *#1 on sheet 2; Page Create Date: March  8, 1995; No Projet: -; Location: https://robot.heig-vd.ch/svn/; Page Modify Date: *
C12 = C_Dup1: PCB Footprint: HEIG/SM/C_0805; Prix Unitaire: 0.14; Référence: 499-687; Ref. Fab: AVX; Prix: 0.06; Ref. Fabricant: 2238 786 15649; Fabricant: PHYCOMP; Quantité min: 10; Distributor: Farnell; Ref. Distributor: 499-687; Price in €: 0.140; Distributeur: Farnell; Ref. Distributeur: 432210
C13 C14 C67-C71 = C_Dup1: PCB Footprint: HEIG/SM/C_0805; Quantité min: 10; Fabricant: AVX; Ref. Fabricant: 06035A220JAT2A; Prix: 0.098; Référence: 499-687; Prix Unitaire: 0.14; Ref. Distributeur: 498543; Distributeur: Farnell; Ref. Fab: AVX; Price in €: 0.140; Ref. Distributor: 499-687; Distributor: Farnell
D1 = Led: PCB Footprint: HEIG/SM/D_0805; Prix: 0.65; Fabricant: ROHM; Ref. Fabricant: SML-210VTT86; Distributeur: Farnell; Ref. Distributeur: 1685054
D2 D4 = D: PCB Footprint: HEIG/SM/DO214
D3 = Led: PCB Footprint: HEIG/SM/D_0805; Fabricant: ROHM; Ref. Fabricant: SML-210VTT86; Prix: 0.65; Quantité min: 1; Distributeur: Farnell; Ref. Distributeur: 1685054
D5-D9 = Led: PCB Footprint: HEIG/SM/D_0805; Ref. Fabricant: SML-210VTT86; Fabricant: ROHM; Prix: 0.65; Ref. Distributeur: 1685054; Distributeur: Farnell
IC3 IC4 = ITS4142N: Fabricant: INFINEON; Prix: 4.30; PCB Footprint: HEIG/SM/SOT223; Distributeur: Farnell; Ref. Distributeur: 1440816; Ref. Fabricant: ITS4142N
IC5 = Xtal Oscillateur: Tolérance: 100ppm; Quantité min: 1; Voltage: 3.3V; Prix: 5.50; Ref. Fabricant: SG-310 SCF C 20.0MHZ; Fabricant: EPSON TOYOCOM; PCB Footprint: HEIG/OSC/SPX0/SG-310; Ref. Distributeur: 1278064; Distributeur: Farnell
R10-R33 = R_Dup3: PCB Footprint: HEIG/SM/R_0805
T1 = BSP318S: Fabricant: INFINEON; Prix: 0.975; Quantité min: 1; PCB Footprint: HEIG/SM/SOT223; Distributeur: Farnell; Ref. Distributeur: 1214267; Ref. Fabricant: BSP318S
U1 = C8051F330_0: PCB Footprint: HEIG/SM/QFN20; Ref. Fabricant: C8051F330GK; Prix: 5.00; Distributeur: Mouser; Ref. Distributeur: C8051F330GK
U2#1 = 7414-1_6: Ref. Fabricant: SN74LVC14AD; Fabricant: TEXAS INSTRUMENTS; Prix: 0.953; Ref. Distributeur: 1102973; Distributeur: Farnell; PCB Footprint: HEIG/SM/SOIC14
U2#2 = 7414-1_7: Prix: 0.953; Fabricant: TEXAS INSTRUMENTS; Ref. Fabricant: SN74LVC14AD; Distributeur: Farnell; Ref. Distributeur: 1102973; PCB Footprint: HEIG/SM/SOIC14
U2#3 = 7414-1_2: Ref. Fabricant: SN74LVC14AD; Fabricant: TEXAS INSTRUMENTS; Prix: 0.953; Ref. Distributeur: 1102973; Distributeur: Farnell; PCB Footprint: HEIG/SM/SOIC14
U2#4 = 7414-1_3: Ref. Fabricant: SN74LVC14AD; Fabricant: TEXAS INSTRUMENTS; Prix: 0.953; Ref. Distributeur: 1102973; Distributeur: Farnell; PCB Footprint: HEIG/SM/SOIC14
U2#5 = 7414-1_4: Prix: 0.953; Fabricant: TEXAS INSTRUMENTS; Ref. Fabricant: SN74LVC14AD; Distributeur: Farnell; Ref. Distributeur: 1102973; PCB Footprint: HEIG/SM/SOIC14
U2#6 = 7414-1_5: Fabricant: TEXAS INSTRUMENTS; Ref. Fabricant: SN74LVC14AD; Prix: 0.953; Distributeur: Farnell; Ref. Distributeur: 1102973; PCB Footprint: HEIG/SM/SOIC14
X3 = Connecteur 06: PCB Footprint: HEIG/WAGO/733-336
X4 X6 X8 X9 = Connecteur 04: PCB Footprint: HEIG/WAGO/733-334
X5 = Connecteur 03_Dup1: PCB Footprint: HEIG/CON/INLINE03
X7 = CON14_0: COMPHEIGHT: 0.000; MEMORY: NO; COMPGROUP: 0; COMPROT: 180; COMPLOC: [-3462.500,5924.500]; COMPSIDE: TOP; FPLIST: BLKCON.100/VH/TM2OE/W.200/14; DECOUPLER: NO; COMPKEY: NO; COMPLOCKED: NO; COMPFIXED: NO; PCB Footprint: HEIG/CON/INLINE14/2
X10 = I2C: Ref. Fab: TYCO 7-215079-4; Distributor: Farnell; Ref. Distributor: 148507; Price in €: 0.57; PCB Footprint: HEIG/CON/MICROMATCH/4F
U3 = TLP281-4: PCB Footprint: HEIG/SM/SOIC16/7.0M
U25 = TLP281: Fabricant: TLP281; Ref. Distributeur: 1225848; Distributeur: Farnell; PCB Footprint: HEIG/SM/SOIC04/7.0M

## Sheet 5.SchDoc
size 594 x 420 mm
Used 2 times, as channels TWO MOTORS, TWO MOTORS1. Parts and nets are listed once, with the designators drawn on the sheet.
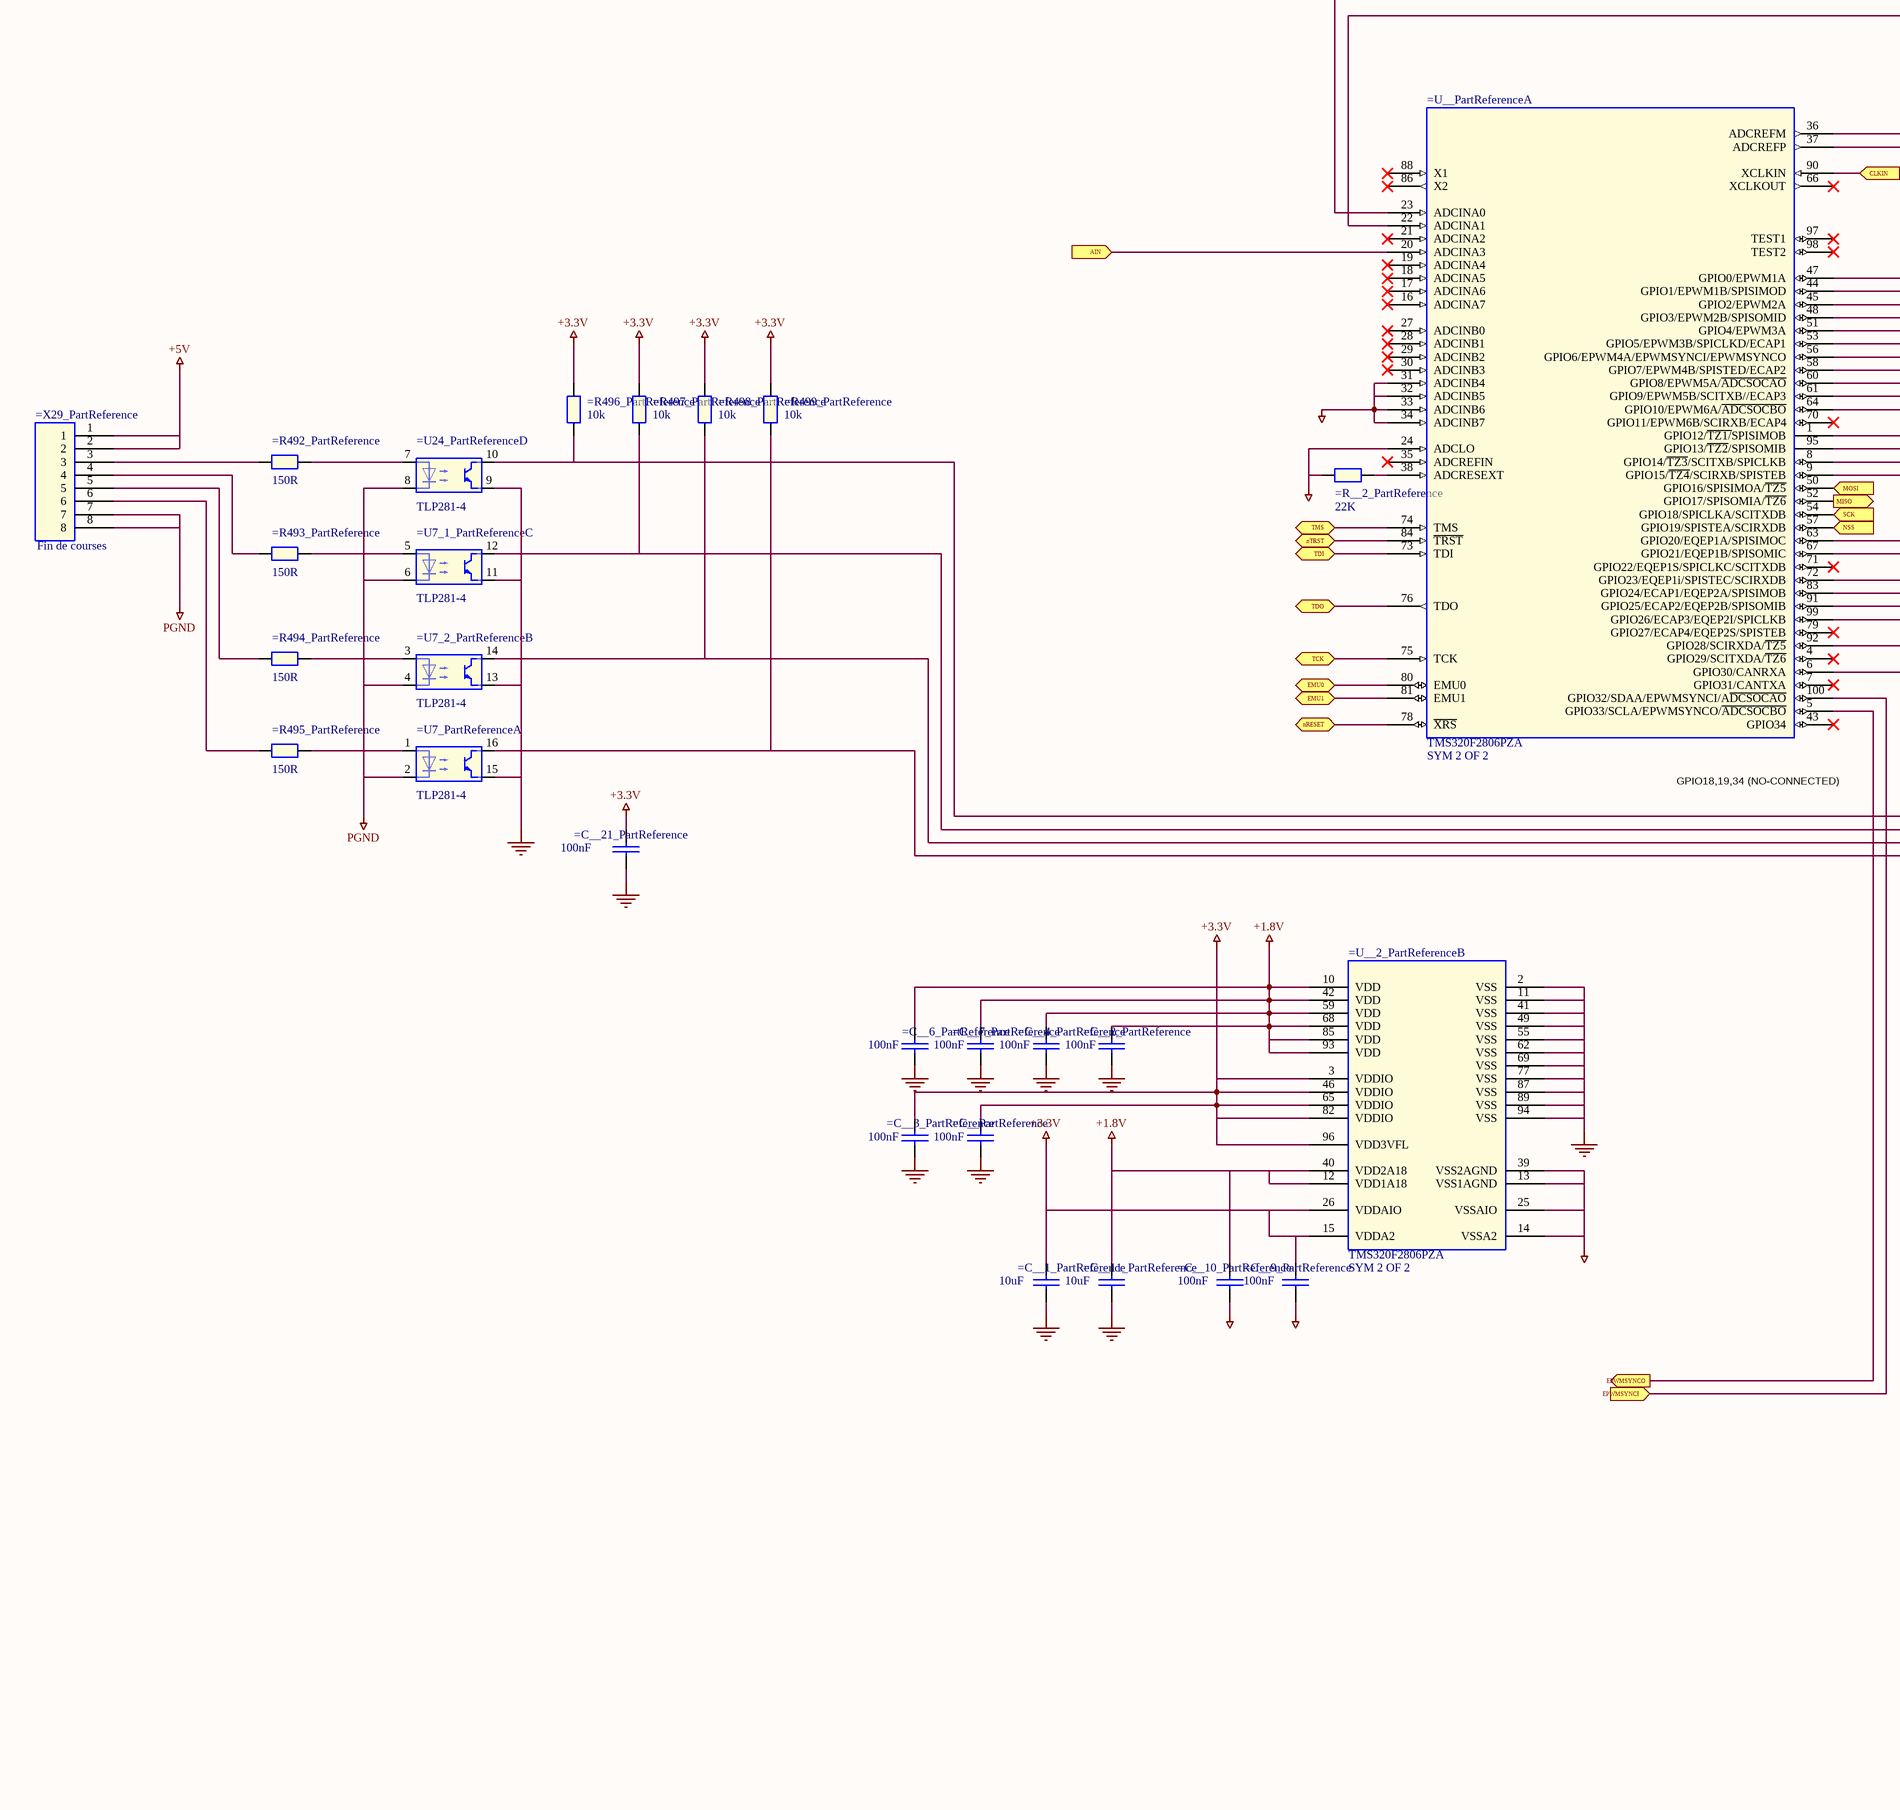
[diagram p4: 5.SchDoc, left]
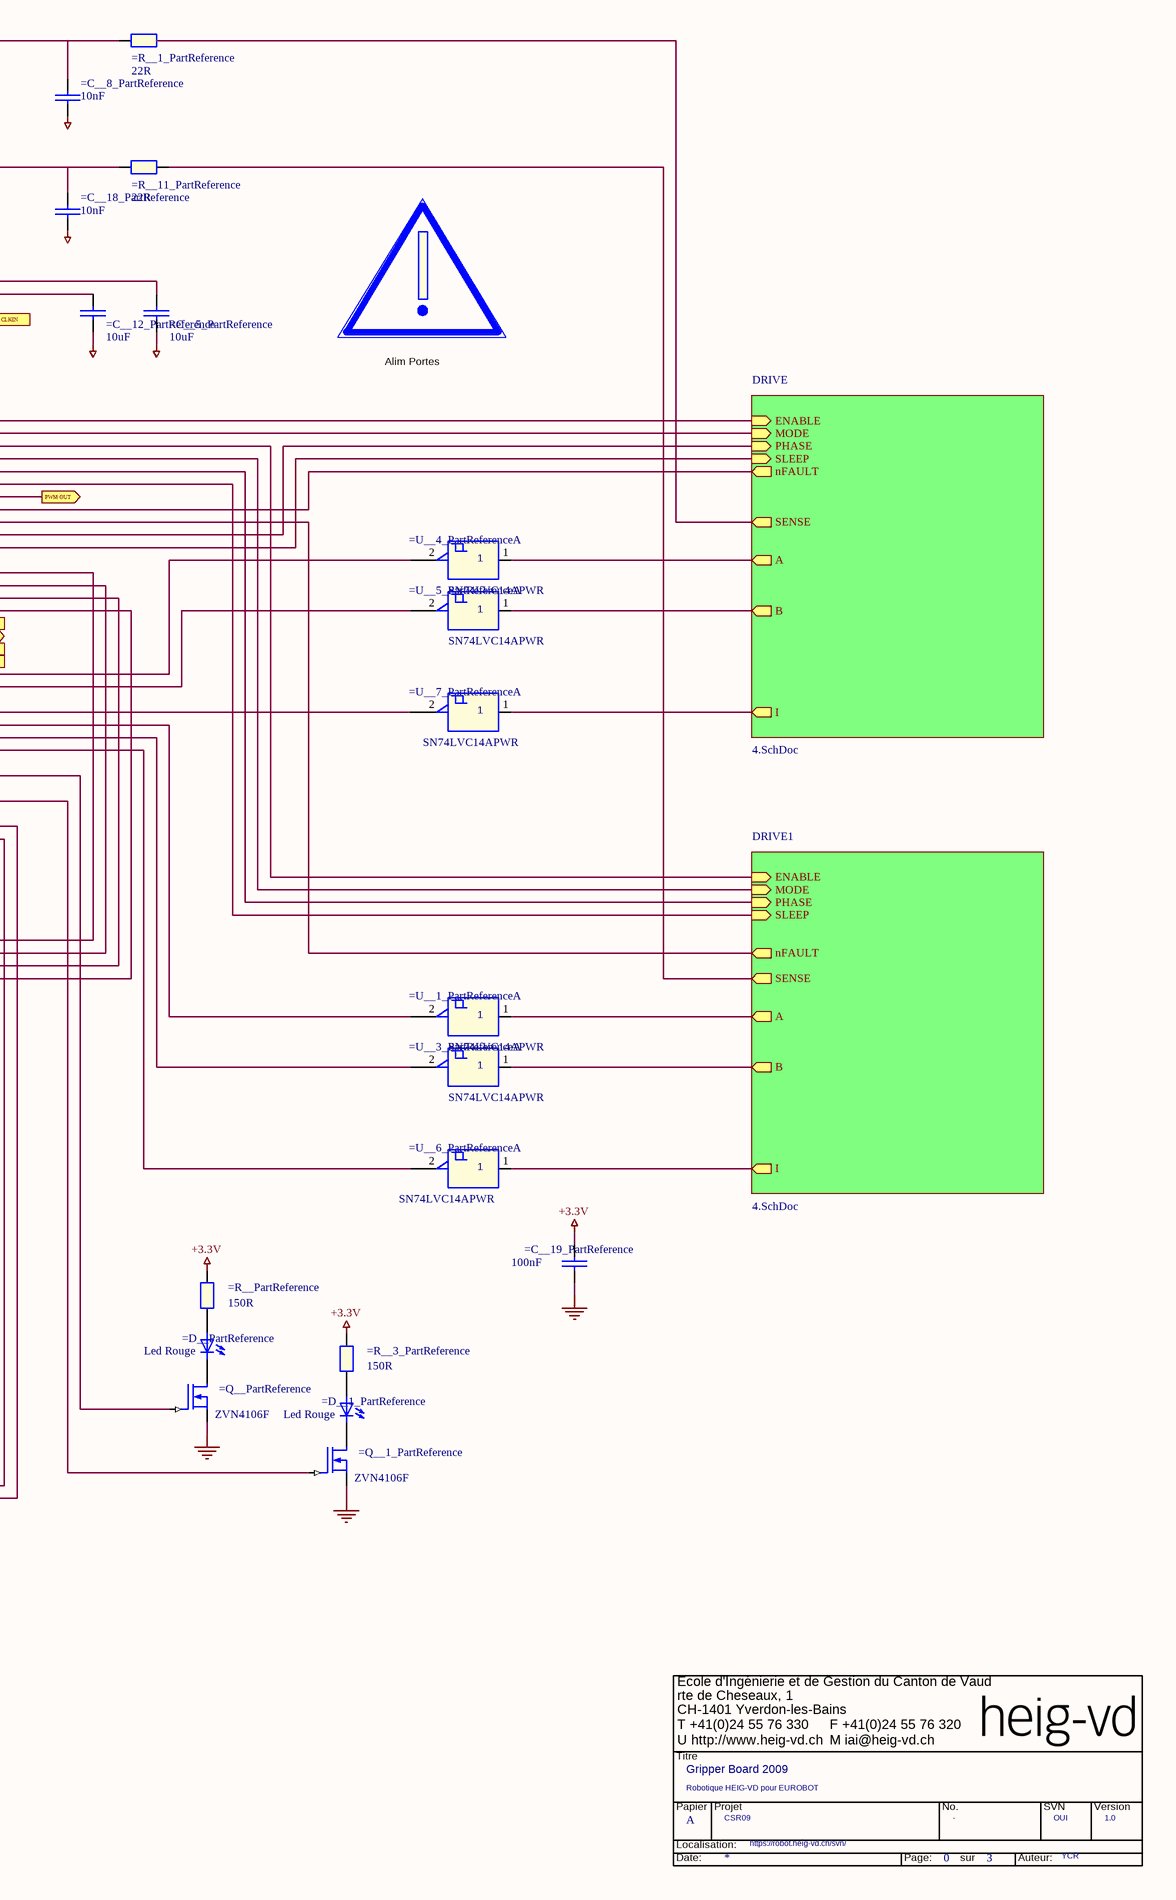
[diagram p5: 5.SchDoc, right]

### Parts
*  RevCode: 1.0  Title: Gripper Board 2009  Page Size: A  Page Number: 0  Page Count: 3  Projet: CSR09  Subtitle: Robotique HEIG-VD pour EUROBOT  Author: YCR  SVN: OUI  (hidden comment: TitleBlock HEIG-VD)  (graphical)
=C__1_PartReference  10uF  [SM/C_0805]
=C__2_PartReference  100nF  [SM/C_0805]
=C__3_PartReference  100nF  [SM/C_0805]
=C__4_PartReference  100nF  [SM/C_0805]
=C__5_PartReference  10uF  [SM/C_0805]
=C__6_PartReference  100nF  [SM/C_0805]
=C__7_PartReference  100nF  [SM/C_0805]
=C__8_PartReference  10nF  [SM/C_0805]
=C__9_PartReference  100nF  [SM/C_0805]
=C__10_PartReference  100nF  [SM/C_0805]
=C__11_PartReference  10uF  [SM/C_0805]
=C__12_PartReference  10uF  [SM/C_0805]
=C__18_PartReference  10nF  [SM/C_0805]
=C__19_PartReference  100nF  [SM/C_0805]
=C__21_PartReference  100nF  [SM/C_0805]
=C__PartReference  100nF  [SM/C_0805]
=D__1_PartReference  Led Rouge  [LED 5]
=D__PartReference  Led Rouge  [LED 5]
=Q__1_PartReference  ZVN4106F  [SM/SOT23_123]
=Q__PartReference  ZVN4106F  [SM/SOT23_123]
=R492_PartReference  150R  [R400]
=R493_PartReference  150R  [R400]
=R494_PartReference  150R  [R400]
=R495_PartReference  150R  [R400]
=R496_PartReference  10k  [R400]
=R497_PartReference  10k  [R400]
=R498_PartReference  10k  [R400]
=R499_PartReference  10k  [R400]
=R__1_PartReference  22R  [R400]
=R__2_PartReference  22K  [R400]
=R__3_PartReference  150R  [R400]
=R__11_PartReference  22R  [R400]
=R__PartReference  150R  [R400]
=U7_1_PartReference  TLP281-4  [HEIG/SM/SOIC16/7.0M]  (part C of 4)
=U7_2_PartReference  TLP281-4  [HEIG/SM/SOIC16/7.0M]  (part B of 4)
=U7_PartReference  TLP281-4  [HEIG/SM/SOIC16/7.0M]  (part A of 4)
=U24_PartReference  TLP281-4  [HEIG/SM/SOIC16/7.0M]  (part D of 4)
=U__1_PartReference  SN74LVC14APWR  [HEIG/SM/SOIC14]  (part A of 6)
=U__2_PartReference  SlotXofY: SYM 2 OF 2  [QUAD.50M/100/WG16.00]  (hidden comment: tms320f2806pza)  (part B of 2)
=U__3_PartReference  SN74LVC14APWR  [HEIG/SM/SOIC14]  (part A of 6)
=U__4_PartReference  SN74LVC14APWR  [HEIG/SM/SOIC14]  (part A of 6)
=U__5_PartReference  SN74LVC14APWR  [HEIG/SM/SOIC14]  (part A of 6)
=U__6_PartReference  SN74LVC14APWR  [HEIG/SM/SOIC14]  (part A of 6)
=U__7_PartReference  SN74LVC14APWR  [HEIG/SM/SOIC14]  (part A of 6)
=U__PartReference  SlotXofY: SYM 2 OF 2  [QUAD.50M/100/WG16.00]  (hidden comment: tms320f2806pza)  (part A of 2)
=WARNING1_PartReference  WARNING  (value not drawn)
=X29_PartReference  Fin de courses  [HEIG/WAGO/733-338]

### Sub-sheets
DRIVE = 4.SchDoc: SLEEP (in), ENABLE (in), MODE (in), nFAULT (out), I (out), PHASE (in), A (out), B (out), SENSE (out)  | ReuseAnnotated: YES; X__PartReference: =DRIVE_X__PartReference; C__15_PartReference: =DRIVE_C__15_PartReference; U__9_PartReference: =DRIVE_U__9_PartReference; C__13_PartReference: =DRIVE_C__13_PartReference; C__16_PartReference: =DRIVE_C__16_PartReference; R__10_PartReference: =DRIVE_R__10_PartReference; C__17_PartReference: =DRIVE_C__17_PartReference; C__20_PartReference: =DRIVE_C__20_PartReference; R__6_PartReference: =DRIVE_R__6_PartReference; R__9_PartReference: =DRIVE_R__9_PartReference; U6_PartReference: =DRIVE_U6_PartReference; R__4_PartReference: =DRIVE_R__4_PartReference; C__14_PartReference: =DRIVE_C__14_PartReference; R__8_PartReference: =DRIVE_R__8_PartReference; R__7_PartReference: =DRIVE_R__7_PartReference; U__8_PartReference: =DRIVE_U__8_PartReference; R__5_PartReference: =DRIVE_R__5_PartReference; TitleBlock_3_Page_Number: =DRIVE_TitleBlock_3_Page_Number
DRIVE1 = 4.SchDoc: SLEEP (in), ENABLE (in), MODE (in), nFAULT (out), I (out), PHASE (in), A (out), B (out), SENSE (out)  | ReuseAnnotated: YES; X__PartReference: =DRIVE1_X__PartReference; C__15_PartReference: =DRIVE1_C__15_PartReference; U__9_PartReference: =DRIVE1_U__9_PartReference; C__13_PartReference: =DRIVE1_C__13_PartReference; C__16_PartReference: =DRIVE1_C__16_PartReference; R__10_PartReference: =DRIVE1_R__10_PartReference; C__17_PartReference: =DRIVE1_C__17_PartReference; C__20_PartReference: =DRIVE1_C__20_PartReference; R__6_PartReference: =DRIVE1_R__6_PartReference; R__9_PartReference: =DRIVE1_R__9_PartReference; U6_PartReference: =DRIVE1_U6_PartReference; R__4_PartReference: =DRIVE1_R__4_PartReference; C__14_PartReference: =DRIVE1_C__14_PartReference; R__8_PartReference: =DRIVE1_R__8_PartReference; R__7_PartReference: =DRIVE1_R__7_PartReference; U__8_PartReference: =DRIVE1_U__8_PartReference; R__5_PartReference: =DRIVE1_R__5_PartReference; TitleBlock_3_Page_Number: =DRIVE1_TitleBlock_3_Page_Number

### Ports
AIN (in), CLKIN (in), EMU0 (bidir), EMU1 (bidir), EPWMSYNCI (in), EPWMSYNCO (out), MISO (out), MOSI (in), nRESET (bidir), NSS (in), nTRST (bidir), PWM OUT (out), SCK (in), TCK (bidir), TDI (bidir), TDO (bidir), TMS (bidir)

### Nets
+1.8V: =C__2_PartReference.1 =C__4_PartReference.1 =C__6_PartReference.1 =C__7_PartReference.1 =C__10_PartReference.1 =C__11_PartReference.1 =U__2_PartReference.10(VDD) =U__2_PartReference.12(VDD1A18) =U__2_PartReference.40(VDD2A18) =U__2_PartReference.42(VDD) =U__2_PartReference.59(VDD) =U__2_PartReference.68(VDD) =U__2_PartReference.85(VDD) =U__2_PartReference.93(VDD)
+3.3V: =C__1_PartReference.1 =C__3_PartReference.1 =C__9_PartReference.1 =C__19_PartReference.1 =C__21_PartReference.1 =C__PartReference.1 =R496_PartReference.1 =R497_PartReference.1 =R498_PartReference.1 =R499_PartReference.1 =R__3_PartReference.1 =R__PartReference.1 =U__1_PartReference.14(+3.3V) =U__2_PartReference.3(VDDIO) =U__2_PartReference.15(VDDA2) =U__2_PartReference.26(VDDAIO) =U__2_PartReference.46(VDDIO) =U__2_PartReference.65(VDDIO) =U__2_PartReference.82(VDDIO) =U__2_PartReference.96(VDD3VFL) =U__3_PartReference.14(+3.3V) =U__4_PartReference.14(+3.3V) =U__5_PartReference.14(+3.3V) =U__6_PartReference.14(+3.3V) =U__7_PartReference.14(+3.3V)
+5V: =X29_PartReference.1 =X29_PartReference.2
AGND: =C__5_PartReference.2 =C__8_PartReference.2 =C__9_PartReference.2 =C__10_PartReference.2 =C__12_PartReference.2 =C__18_PartReference.2 =R__2_PartReference.1 =U__2_PartReference.13(VSS1AGND) =U__2_PartReference.14(VSSA2) =U__2_PartReference.25(VSSAIO) =U__2_PartReference.39(VSS2AGND) =U__PartReference.24(ADCLO) =U__PartReference.31(ADCINB4) =U__PartReference.32(ADCINB5) =U__PartReference.33(ADCINB6) =U__PartReference.34(ADCINB7)
GND: =C__1_PartReference.2 =C__2_PartReference.2 =C__3_PartReference.2 =C__4_PartReference.2 =C__6_PartReference.2 =C__7_PartReference.2 =C__11_PartReference.2 =C__19_PartReference.2 =C__21_PartReference.2 =C__PartReference.2 =Q__1_PartReference.2(SOURCE) =Q__PartReference.2(SOURCE) =U7_1_PartReference.11(E) =U7_2_PartReference.13(E) =U7_PartReference.15(E) =U24_PartReference.9(E) =U__1_PartReference.7(GND) =U__2_PartReference.2(VSS) =U__2_PartReference.11(VSS) =U__2_PartReference.41(VSS) =U__2_PartReference.49(VSS) =U__2_PartReference.55(VSS) =U__2_PartReference.62(VSS) =U__2_PartReference.69(VSS) =U__2_PartReference.77(VSS) =U__2_PartReference.87(VSS) =U__2_PartReference.89(VSS) =U__2_PartReference.94(VSS) =U__3_PartReference.7(GND) =U__4_PartReference.7(GND) =U__5_PartReference.7(GND) =U__6_PartReference.7(GND) =U__7_PartReference.7(GND)
PGND: =U7_1_PartReference.6(C) =U7_2_PartReference.4(C) =U7_PartReference.2(C) =U24_PartReference.8(C) =X29_PartReference.7 =X29_PartReference.8
AIN: =U__PartReference.20(ADCINA3) ; port AIN
CLKIN: =U__PartReference.90(XCLKIN) ; port CLKIN
EMU0: =U__PartReference.80(EMU0) ; port EMU0
EMU1: =U__PartReference.81(EMU1) ; port EMU1
EPWMSYNCI: =U__PartReference.100(GPIO32/SDAA/EPWMSYNCI/A~{DCSOCAO}) ; port EPWMSYNCI
EPWMSYNCO: =U__PartReference.5(GPIO33/SCLA/EPWMSYNCO/~{ADCSOCBO}) ; port EPWMSYNCO
MISO: =U__PartReference.52(GPIO17/SPISOMIA/~{TZ6}) ; port MISO
MOSI: =U__PartReference.50(GPIO16/SPISIMOA/~{TZ5}) ; port MOSI
nRESET: =U__PartReference.78(~{XRS}) ; port nRESET
NSS: =U__PartReference.57(GPIO19/SPISTEA/SCIRXDB) ; port NSS
nTRST: =U__PartReference.84(~{TRST}) ; port nTRST
PWM OUT: =U__PartReference.56(GPIO6/EPWM4A/EPWMSYNCI/EPWMSYNCO) ; port PWM OUT
SCK: =U__PartReference.54(GPIO18/SPICLKA/SCITXDB) ; port SCK
TCK: =U__PartReference.75(TCK) ; port TCK
TDI: =U__PartReference.73(TDI) ; port TDI
TDO: =U__PartReference.76(TDO) ; port TDO
TMS: =U__PartReference.74(TMS) ; port TMS
Net=C__5_PartReference_1: =C__5_PartReference.1 =U__PartReference.36(ADCREFM)
Net=C__8_PartReference_1: =C__8_PartReference.1 =R__1_PartReference.2 =U__PartReference.23(ADCINA0)
Net=C__12_PartReference_1: =C__12_PartReference.1 =U__PartReference.37(ADCREFP)
Net=C__18_PartReference_1: =C__18_PartReference.1 =R__11_PartReference.2 =U__PartReference.22(ADCINA1)
Net=D__1_PartReference_1: =D__1_PartReference.1 =Q__1_PartReference.3(DRAIN)
Net=D__1_PartReference_2: =D__1_PartReference.2 =R__3_PartReference.2
Net=D__PartReference_1: =D__PartReference.1 =Q__PartReference.3(DRAIN)
Net=D__PartReference_2: =D__PartReference.2 =R__PartReference.2
Net=Q__1_PartReference_1: =Q__1_PartReference.1(GATE) =U__PartReference.6(GPIO30/CANRXA)
Net=Q__PartReference_1: =Q__PartReference.1(GATE) =U__PartReference.92(GPIO28/SCIRXDA/~{TZ5})
Net=R492_PartReference_1: =R492_PartReference.1 =X29_PartReference.3
Net=R492_PartReference_2: =R492_PartReference.2 =U24_PartReference.7(A)
Net=R493_PartReference_1: =R493_PartReference.1 =X29_PartReference.4
Net=R493_PartReference_2: =R493_PartReference.2 =U7_1_PartReference.5(A)
Net=R494_PartReference_1: =R494_PartReference.1 =X29_PartReference.5
Net=R494_PartReference_2: =R494_PartReference.2 =U7_2_PartReference.3(A)
Net=R495_PartReference_1: =R495_PartReference.1 =X29_PartReference.6
Net=R495_PartReference_2: =R495_PartReference.2 =U7_PartReference.1(A)
Net=R496_PartReference_2: =R496_PartReference.2 =U24_PartReference.10(COL) =U__PartReference.1(GPIO12/~{TZ1/}SPISIMOB)
Net=R497_PartReference_2: =R497_PartReference.2 =U7_1_PartReference.12(COL) =U__PartReference.95(GPIO13/~{TZ2}/SPISOMIB)
Net=R498_PartReference_2: =R498_PartReference.2 =U7_2_PartReference.14(COL) =U__PartReference.8(GPIO14/~{TZ3}/SCITXB/SPICLKB)
Net=R499_PartReference_2: =R499_PartReference.2 =U7_PartReference.16(COL) =U__PartReference.9(GPIO15/~{TZ4}/SCIRXB/SPISTEB)
Net=R__1_PartReference_1: =R__1_PartReference.1 ; sheet DRIVE/SENSE
Net=R__2_PartReference_2: =R__2_PartReference.2 =U__PartReference.38(ADCRESEXT)
Net=R__11_PartReference_1: =R__11_PartReference.1 ; sheet DRIVE1/SENSE
Net=U__1_PartReference_1: =U__1_PartReference.1(6A) ; sheet DRIVE1/A
Net=U__1_PartReference_2: =U__1_PartReference.2(6Y) =U__PartReference.83(GPIO24/ECAP1/EQEP2A/SPISIMOB)
Net=U__3_PartReference_1: =U__3_PartReference.1(6A) ; sheet DRIVE1/B
Net=U__3_PartReference_2: =U__3_PartReference.2(6Y) =U__PartReference.91(GPIO25/ECAP2/EQEP2B/SPISOMIB)
Net=U__4_PartReference_1: =U__4_PartReference.1(6A) ; sheet DRIVE/A
Net=U__4_PartReference_2: =U__4_PartReference.2(6Y) =U__PartReference.63(GPIO20/EQEP1A/SPISIMOC)
Net=U__5_PartReference_1: =U__5_PartReference.1(6A) ; sheet DRIVE/B
Net=U__5_PartReference_2: =U__5_PartReference.2(6Y) =U__PartReference.67(GPIO21/EQEP1B/SPISOMIC)
Net=U__6_PartReference_1: =U__6_PartReference.1(6A) ; sheet DRIVE1/I
Net=U__6_PartReference_2: =U__6_PartReference.2(6Y) =U__PartReference.99(GPIO26/ECAP3/EQEP2I/SPICLKB)
Net=U__7_PartReference_1: =U__7_PartReference.1(6A) ; sheet DRIVE/I
Net=U__7_PartReference_2: =U__7_PartReference.2(6Y) =U__PartReference.72(GPIO23/EQEP1i/SPISTEC/SCIRXDB)
Net=U__PartReference_44: =U__PartReference.44(GPIO1/EPWM1B/SPISIMOD) ; sheet DRIVE/MODE
Net=U__PartReference_45: =U__PartReference.45(GPIO2/EPWM2A) ; sheet DRIVE1/ENABLE
Net=U__PartReference_47: =U__PartReference.47(GPIO0/EPWM1A) ; sheet DRIVE/ENABLE
Net=U__PartReference_48: =U__PartReference.48(GPIO3/EPWM2B/SPISOMID) ; sheet DRIVE1/MODE
Net=U__PartReference_51: =U__PartReference.51(GPIO4/EPWM3A) ; sheet DRIVE1/PHASE
Net=U__PartReference_53: =U__PartReference.53(GPIO5/EPWM3B/SPICLKD/ECAP1) ; sheet DRIVE1/SLEEP
Net=U__PartReference_58: =U__PartReference.58(GPIO7/EPWM4B/SPISTED/ECAP2) ; sheet DRIVE/nFAULT
Net=U__PartReference_60: =U__PartReference.60(GPIO8/EPWM5A/~{ADCSOCAO}) ; sheet DRIVE1/nFAULT
Net=U__PartReference_61: =U__PartReference.61(GPIO9/EPWM5B/SCITXB//ECAP3) ; sheet DRIVE/PHASE
Net=U__PartReference_64: =U__PartReference.64(GPIO10/EPWM6A/~{ADCSOCBO}) ; sheet DRIVE/SLEEP

Not connected (* = marked no-connect by the designer): =U__PartReference 4(GPIO29/SCITXDA/~{TZ6})* 7(GPIO31/CANTXA)* 16(ADCINA7)* 17(ADCINA6)* 18(ADCINA5)* 19(ADCINA4)* 21(ADCINA2)* 27(ADCINB0)* 28(ADCINB1)* 29(ADCINB2)* 30(ADCINB3)* 35(ADCREFIN)* 43(GPIO34)* 66(XCLKOUT)* 70(GPIO11/EPWM6B/SCIRXB/ECAP4)* 71(GPIO22/EQEP1S/SPICLKC/SCITXDB)* 79(GPIO27/ECAP4/EQEP2S/SPISTEB)* 86(X2)* 88(X1)* 97(TEST1)* 98(TEST2)*

### Channels
TWO MOTORS: designators end in _TWO_MOTORS; ports AIN=Net=U__PartReference_TWO_MOTORS_20 CLKIN=Net=U__PartReference_TWO_MOTORS_90 EMU0=Net=U__PartReference_TWO_MOTORS_80 EMU1=Net=U__PartReference_TWO_MOTORS_81 EPWMSYNCI=Net=U__PartReference_TWO_MOTORS_100 EPWMSYNCO=Net=U__PartReference_TWO_MOTORS_5 MISO=Net=U__PartReference_TWO_MOTORS_52 MOSI=Net=U__PartReference_TWO_MOTORS_50 nRESET=Net=U__PartReference_TWO_MOTORS_78 NSS=Net=U__PartReference_TWO_MOTORS_57 nTRST=Net=U__PartReference_TWO_MOTORS_84 PWM OUT=Net=U__PartReference_TWO_MOTORS_56 SCK=Net=U__PartReference_TWO_MOTORS_54 TCK=Net=U__PartReference_TWO_MOTORS_75 TDI=Net=U__PartReference_TWO_MOTORS_73 TDO=Net=U__PartReference_TWO_MOTORS_76 TMS=Net=U__PartReference_TWO_MOTORS_74
TWO MOTORS1: designators end in _TWO_MOTORS1; ports AIN=Net=U__PartReference_TWO_MOTORS1_20 CLKIN=Net=U__PartReference_TWO_MOTORS1_90 EMU0=Net=U__PartReference_TWO_MOTORS_80 EMU1=Net=U__PartReference_TWO_MOTORS_81 EPWMSYNCI=Net=U__PartReference_TWO_MOTORS_5 EPWMSYNCO=Net=U__PartReference_TWO_MOTORS1_5 MISO=Net=U__PartReference_TWO_MOTORS_52 MOSI=Net=U__PartReference_TWO_MOTORS_50 nRESET=Net=U__PartReference_TWO_MOTORS_78 NSS=Net=U__PartReference_TWO_MOTORS1_57 nTRST=Net=U__PartReference_TWO_MOTORS_84 PWM OUT=Net=U__PartReference_TWO_MOTORS1_56 SCK=Net=U__PartReference_TWO_MOTORS_54 TCK=Net=U__PartReference_TWO_MOTORS_75 TDI=Net=U__PartReference_TWO_MOTORS_76 TDO=Net=U__PartReference_TWO_MOTORS1_76 TMS=Net=U__PartReference_TWO_MOTORS_74

### Notes on the sheet
- Alim Portes
- GPIO18,19,34 (NO-CONNECTED)
- (in symbol TitleBlock HEIG-VD) Ecole d'Ingénierie et de Gestion du Canton de Vaud; rte de Cheseaux, 1; CH-1401 Yverdon-les-Bains; T +41(0)24 55 76 330; F +41(0)24 55 76 320; U http://www.heig-vd.ch; M iai@heig-vd.ch; Titre; Papier; Projet; No.; SVN; Version; Localisation:; Date:; Page:; sur; Auteur:

### Library data of the parts
* = TitleBlock HEIG-VD: as *#1 on sheet 2; Page Create Date: March  8, 1995; No Projet: -; Location: https://robot.heig-vd.ch/svn/; Page Modify Date: *; Page_Number: =TitleBlock_Page_Number
=C__1_PartReference =C__3_PartReference =C__6_PartReference =C__9_PartReference =C__10_PartReference =C__11_PartReference =C__PartReference = C_Dup1: Ref. Fabricant: PHYCOMP; Prix: 0.06; Ref. Fab: AVX; PCB Footprint: HEIG/SM/C_0805; Distributeur: Farnell; Ref. Distributeur: 432210; Distributor: Farnell; Price in €: 0.140; Ref. Distributor: 499-687
=C__2_PartReference =C__4_PartReference =C__7_PartReference =C__8_PartReference =C__18_PartReference =C__19_PartReference =C__21_PartReference = C_Dup1: Ref. Fab: AVX; Prix: 0.06; Ref. Fabricant: PHYCOMP; PCB Footprint: HEIG/SM/C_0805; Ref. Distributor: 499-687; Price in €: 0.140; Distributor: Farnell; Ref. Distributeur: 432210; Distributeur: Farnell
=C__5_PartReference =C__12_PartReference = C_Dup1: fab: B45196-E2225K109; Prix Unitaire: 0.40; Designation: Tantale standard; Référence: 757-720; VOLTAGE: 10V; Ref. Fab: AVXMCCTA106M006.MULTICOMP; Prix: 0.36; Ref. Fabricant: AVX; PCB Footprint: HEIG/SM/C_0805; Distributor: Farnell; Ref. Distributor: 967-014; Price in €: 0.87; Ref. Distributeur: 498660; Distributeur: Farnell
=D__1_PartReference = Led_0: Ref. Fab: QTLP670C-2... FAIRCHILD SEMICONDUCTOR; Ref. Fabricant: VISHAY TLMT3100-GS08; Prix: 0.20; PCB Footprint: HEIG/SM/D_0805; Distributor: Farnell; Ref. Distributor: 3599917; Price in €: 0.144; Ref. Distributeur: 8311510; Distributeur: Farnell
=D__PartReference = Led_0: Prix: 0.20; Ref. Fabricant: VISHAY TLMT3100-GS08; Ref. Fab: QTLP670C-2... FAIRCHILD SEMICONDUCTOR; PCB Footprint: HEIG/SM/D_0805; Distributeur: Farnell; Ref. Distributeur: 8311510; Price in €: 0.144; Ref. Distributor: 3599917; Distributor: Farnell
=Q__1_PartReference = MOSFET N_0: Ref. Fabricant: ZETEX; Prix: 0.54; COMPHEIGHT: 0.000; MEMORY: NO; COMPGROUP: 0; COMPROT: 270; COMPLOC: [1962.500,750.000]; COMPSIDE: TOP; Distributeur: Farnell; Ref. Distributeur: 516650; DECOUPLER: NO; COMPKEY: NO; COMPLOCKED: NO; COMPFIXED: NO; PCB Footprint: SM/SOT23_123
=Q__PartReference = MOSFET N_0: COMPSIDE: TOP; COMPLOC: [1962.500,750.000]; COMPROT: 270; COMPGROUP: 0; COMPFIXED: NO; COMPHEIGHT: 0.000; Prix: 0.54; Ref. Fabricant: ZETEX; COMPLOCKED: NO; COMPKEY: NO; DECOUPLER: NO; MEMORY: NO; Ref. Distributeur: 516650; Distributeur: Farnell; PCB Footprint: SM/SOT23_123
=R492_PartReference =R493_PartReference =R494_PartReference =R495_PartReference = R_Dup3: PCB Footprint: HEIG/SM/R_0805
=R496_PartReference =R497_PartReference =R498_PartReference =R499_PartReference = R: PCB Footprint: HEIG/SM/R_0805
=R__1_PartReference =R__11_PartReference = R_Dup3: Ref. Fabricant: MULTICOMP; Prix: 0.028; PCB Footprint: HEIG/SM/R_0805; Distributeur: Farnell; Ref. Distributeur: 9331751
=R__2_PartReference = R_Dup3: PCB Footprint: HEIG/SM/R_0805; Ref. Fab: multicomp; Prix: 0.028; Distributor: Farnell; Price in €: 0.037; Ref. Distributor: 613-861; Ref. Distributeur: 9331921; Distributeur: Farnell; Ref. Fabricant: MULTICOMP
=R__3_PartReference = R_Dup3: Tolerance: 0.1%; Ref. Fab: multicomp; Prix: 0.028; PCB Footprint: HEIG/SM/R_0805; Ref. Distributor: 613-587; Price in €: 0.037; Distributor: Farnell; Distributeur: Farnell; Ref. Distributeur: 9331794; Ref. Fabricant: MULTICOMP
=R__PartReference = R_Dup3: Ref. Fabricant: MULTICOMP; Prix: 0.028; Tolerance: 0.1%; PCB Footprint: HEIG/SM/R_0805; Ref. Distributeur: 9331794; Distributeur: Farnell; Distributor: Farnell; Ref. Fab: multicomp; Price in €: 0.037; Ref. Distributor: 613-587
=U__1_PartReference = 7414_7: Prix: 0.953; Ref. Fabricant: SN74LVC14AD; Fabricant: TEXAS INSTRUMENTS; PCB Footprint: HEIG/SM/SOIC14; Ref. Distributeur: 1102973; Distributeur: Farnell; Distributor: Spoerle
=U__2_PartReference =U__PartReference = TMS320F2806PZA_0: Instance: ?; BoardLocation: ?; RefLocation: ?; SymName: TMS320F2806PZA; Ref. Fab: TMS 320 F2806 PZA; Distributor: Spoerle; Ref. Distributor: 214162; Price in €: 22.2; PCB Footprint: QUAD.50M/100/WG16.00
=U__3_PartReference = 7414_8: Prix: 0.953; Ref. Fabricant: SN74LVC14AD; Fabricant: TEXAS INSTRUMENTS; PCB Footprint: HEIG/SM/SOIC14; Ref. Distributeur: 1102973; Distributeur: Farnell; Distributor: Spoerle
=U__4_PartReference = 7414_4: Prix: 0.953; Ref. Fabricant: SN74LVC14AD; Fabricant: TEXAS INSTRUMENTS; PCB Footprint: HEIG/SM/SOIC14; Ref. Distributeur: 1102973; Distributeur: Farnell; Distributor: Spoerle
=U__5_PartReference = 7414_5: Fabricant: TEXAS INSTRUMENTS; Ref. Fabricant: SN74LVC14AD; Prix: 0.953; PCB Footprint: HEIG/SM/SOIC14; Distributor: Spoerle; Distributeur: Farnell; Ref. Distributeur: 1102973
=U__6_PartReference = 7414_9: Fabricant: TEXAS INSTRUMENTS; Ref. Fabricant: SN74LVC14AD; Prix: 0.953; PCB Footprint: HEIG/SM/SOIC14; Distributor: Spoerle; Distributeur: Farnell; Ref. Distributeur: 1102973
=U__7_PartReference = 7414_6: Prix: 0.953; Ref. Fabricant: SN74LVC14AD; Fabricant: TEXAS INSTRUMENTS; PCB Footprint: HEIG/SM/SOIC14; Ref. Distributeur: 1102973; Distributeur: Farnell; Distributor: Spoerle
=X29_PartReference = Connecteur 08: PCB Footprint: HEIG/WAGO/733-338
=U7_1_PartReference =U7_2_PartReference =U7_PartReference =U24_PartReference = TLP281-4: PCB Footprint: HEIG/SM/SOIC16/7.0M

## Sheet 4.SchDoc
size 420 x 297 mm
Used 4 times, as channels TWO MOTORS/DRIVE1, TWO MOTORS/DRIVE, TWO MOTORS1/DRIVE1, TWO MOTORS1/DRIVE. Parts and nets are listed once, with the designators drawn on the sheet.
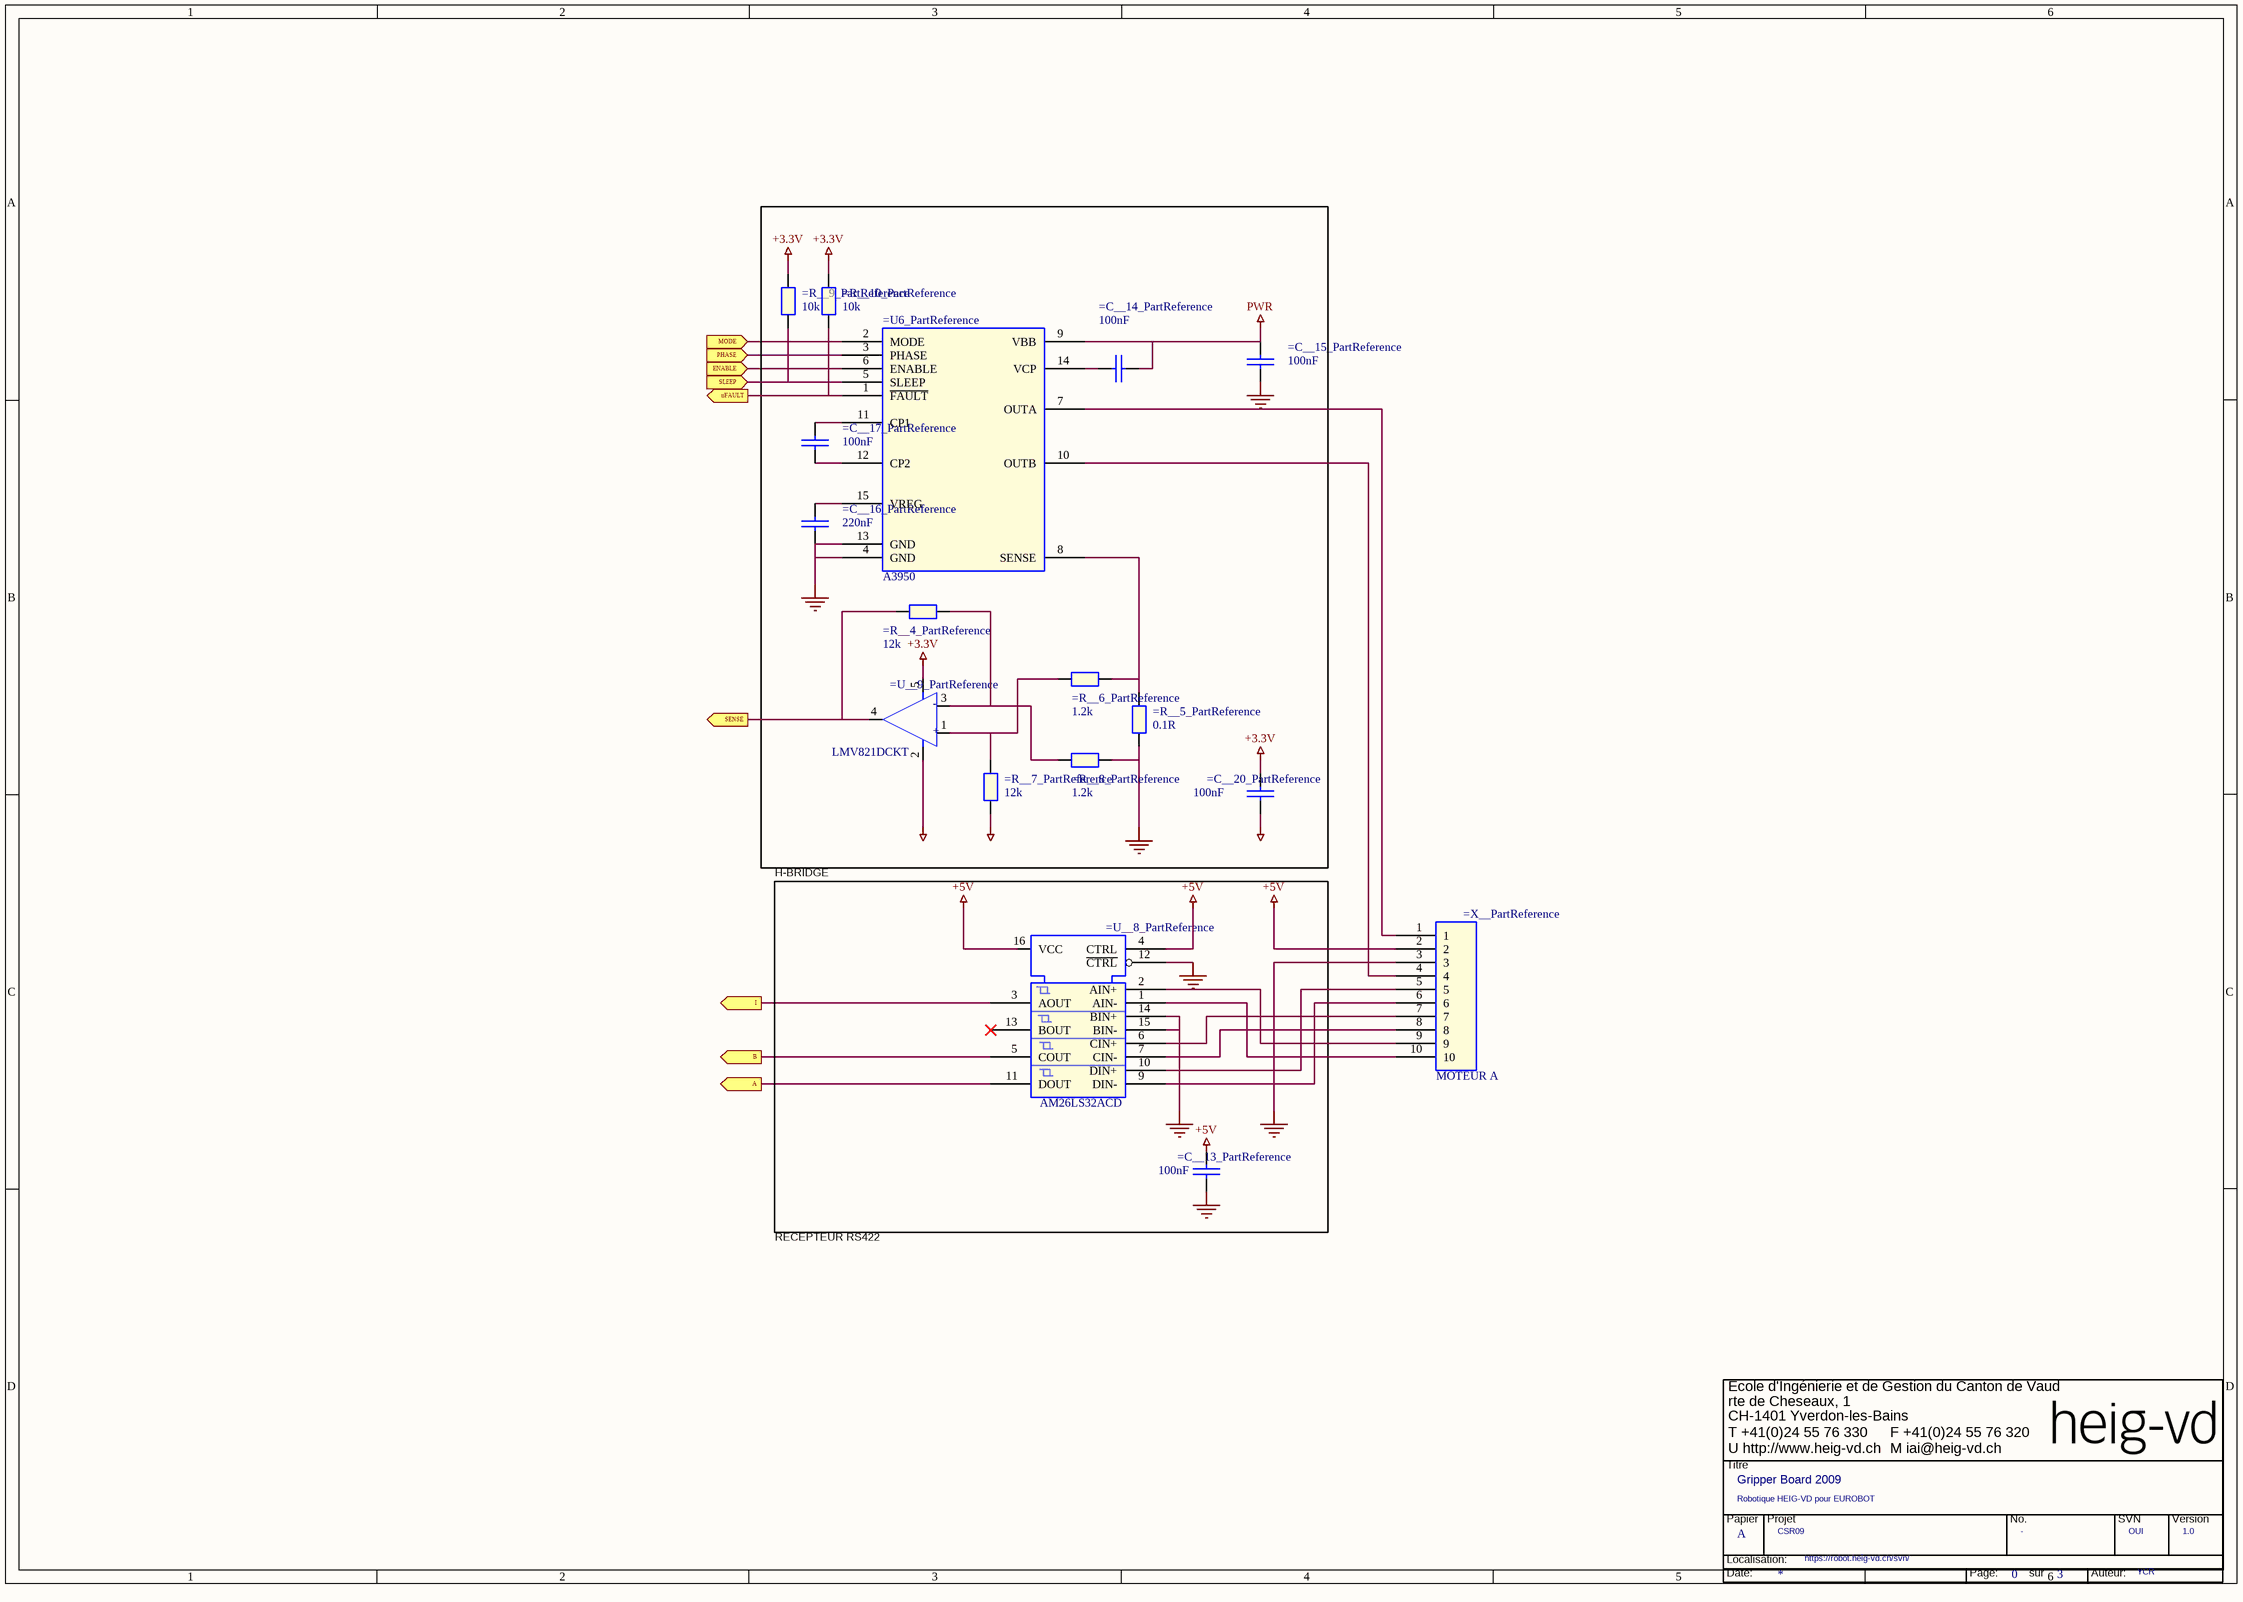
[diagram p6: 4.SchDoc]

### Parts
*  RevCode: 1.0  Title: Gripper Board 2009  Page Size: A  Page Number: 0  Page Count: 3  Projet: CSR09  Subtitle: Robotique HEIG-VD pour EUROBOT  Author: YCR  SVN: OUI  (hidden comment: TitleBlock HEIG-VD)  (graphical)
=C__13_PartReference  100nF  [SM/C_0805]
=C__14_PartReference  100nF  [SM/C_0805]
=C__15_PartReference  100nF  [SM/C_0805]
=C__16_PartReference  220nF  [SM/C_0805]
=C__17_PartReference  100nF  [SM/C_0805]
=C__20_PartReference  100nF  [SM/C_0805]
=R__4_PartReference  12k  [R400]
=R__5_PartReference  0.1R  [R400]
=R__6_PartReference  1.2k  [R400]
=R__7_PartReference  12k  [R400]
=R__8_PartReference  1.2k  [R400]
=R__9_PartReference  10k  [R400]
=R__10_PartReference  10k  [R400]
=U6_PartReference  A3950  [HEIG/SM/TSSOP16]
=U__8_PartReference  AM26LS32ACD  [HEIG/SM/SOIC16]
=U__9_PartReference  LMV821DCKT  [HEIG/SM/SC70]
=X__PartReference  MOTEUR A  [HEIG/CONN/HE10/10]

### Blocks framed on the sheet
H-BRIDGE: =C__13_PartReference =U__8_PartReference

### Ports
A (out), B (out), ENABLE (in), I (out), MODE (in), nFAULT (out), PHASE (in), SENSE (out), SLEEP (in)

### Nets
+3.3V: =C__20_PartReference.1 =R__9_PartReference.2 =R__10_PartReference.2 =U__9_PartReference.5(VCC)
+5V: =C__13_PartReference.1 =U__8_PartReference.4(CTRL) =U__8_PartReference.16(VCC) =X__PartReference.2
AGND: =C__20_PartReference.2 =R__7_PartReference.1 =U__9_PartReference.2(GND)
GND: =C__13_PartReference.2 =C__15_PartReference.2 =C__16_PartReference.2 =R__5_PartReference.1 =R__8_PartReference.1 =U6_PartReference.4(GND) =U6_PartReference.13(GND) =U__8_PartReference.8(GND) =U__8_PartReference.12(~{CTRL}) =U__8_PartReference.14(BIN+) =U__8_PartReference.15(BIN-) =X__PartReference.3
PWR: =C__14_PartReference.1 =C__15_PartReference.1 =U6_PartReference.9(VBB)
A: =U__8_PartReference.11(DOUT) ; port A
B: =U__8_PartReference.5(COUT) ; port B
ENABLE: =U6_PartReference.6(ENABLE) ; port ENABLE
I: =U__8_PartReference.3(AOUT) ; port I
MODE: =U6_PartReference.2(MODE) ; port MODE
nFAULT: =R__10_PartReference.1 =U6_PartReference.1(~{FAULT}) ; port nFAULT
PHASE: =U6_PartReference.3(PHASE) ; port PHASE
SENSE: =R__4_PartReference.2 =U__9_PartReference.4(out) ; port SENSE
SLEEP: =R__9_PartReference.1 =U6_PartReference.5(SLEEP) ; port SLEEP
Net=C__14_PartReference_2: =C__14_PartReference.2 =U6_PartReference.14(VCP)
Net=C__16_PartReference_1: =C__16_PartReference.1 =U6_PartReference.15(VREG)
Net=C__17_PartReference_1: =C__17_PartReference.1 =U6_PartReference.11(CP1)
Net=C__17_PartReference_2: =C__17_PartReference.2 =U6_PartReference.12(CP2)
Net=R__4_PartReference_1: =R__4_PartReference.1 =R__8_PartReference.2 =U__9_PartReference.3(IN-)
Net=R__5_PartReference_2: =R__5_PartReference.2 =R__6_PartReference.1 =U6_PartReference.8(SENSE)
Net=R__6_PartReference_2: =R__6_PartReference.2 =R__7_PartReference.2 =U__9_PartReference.1(IN+)
Net=U6_PartReference_7: =U6_PartReference.7(OUTA) =X__PartReference.1
Net=U6_PartReference_10: =U6_PartReference.10(OUTB) =X__PartReference.4
Net=U__8_PartReference_1: =U__8_PartReference.1(AIN-) =X__PartReference.10
Net=U__8_PartReference_2: =U__8_PartReference.2(AIN+) =X__PartReference.9
Net=U__8_PartReference_6: =U__8_PartReference.6(CIN+) =X__PartReference.7
Net=U__8_PartReference_7: =U__8_PartReference.7(CIN-) =X__PartReference.8
Net=U__8_PartReference_9: =U__8_PartReference.9(DIN-) =X__PartReference.6
Net=U__8_PartReference_10: =U__8_PartReference.10(DIN+) =X__PartReference.5

Not connected (* = marked no-connect by the designer): =U__8_PartReference 13(BOUT)*

### Channels
TWO MOTORS/DRIVE1: designators end in _TWO_MOTORS_DRIVE1; ports A=Net=U__1_PartReference_TWO_MOTORS_1 B=Net=U__3_PartReference_TWO_MOTORS_1 ENABLE=Net=U6_PartReference_TWO_MOTORS_DRIVE1_6 I=Net=U__6_PartReference_TWO_MOTORS_1 MODE=Net=U6_PartReference_TWO_MOTORS_DRIVE1_2 nFAULT=Net=R__10_PartReference_TWO_MOTORS_DRIVE1_1 PHASE=Net=U6_PartReference_TWO_MOTORS_DRIVE1_3 SENSE=Net=R__4_PartReference_TWO_MOTORS_DRIVE1_2 SLEEP=Net=R__9_PartReference_TWO_MOTORS_DRIVE1_1
TWO MOTORS/DRIVE: designators end in _TWO_MOTORS_DRIVE; ports A=Net=U__4_PartReference_TWO_MOTORS_1 B=Net=U__5_PartReference_TWO_MOTORS_1 ENABLE=Net=U6_PartReference_TWO_MOTORS_DRIVE_6 I=Net=U__7_PartReference_TWO_MOTORS_1 MODE=Net=U6_PartReference_TWO_MOTORS_DRIVE_2 nFAULT=Net=R__10_PartReference_TWO_MOTORS_DRIVE_1 PHASE=Net=U6_PartReference_TWO_MOTORS_DRIVE_3 SENSE=Net=R__1_PartReference_TWO_MOTORS_1 SLEEP=Net=R__9_PartReference_TWO_MOTORS_DRIVE_1
TWO MOTORS1/DRIVE1: designators end in _TWO_MOTORS1_DRIVE1; ports A=Net=U__1_PartReference_TWO_MOTORS1_1 B=Net=U__3_PartReference_TWO_MOTORS1_1 ENABLE=Net=U6_PartReference_TWO_MOTORS1_DRIVE1_6 I=Net=U__6_PartReference_TWO_MOTORS1_1 MODE=Net=U6_PartReference_TWO_MOTORS1_DRIVE1_2 nFAULT=Net=R__10_PartReference_TWO_MOTORS1_DRIVE1_1 PHASE=Net=U6_PartReference_TWO_MOTORS1_DRIVE1_3 SENSE=Net=R__4_PartReference_TWO_MOTORS1_DRIVE1_2 SLEEP=Net=R__9_PartReference_TWO_MOTORS1_DRIVE1_1
TWO MOTORS1/DRIVE: designators end in _TWO_MOTORS1_DRIVE; ports A=Net=U__4_PartReference_TWO_MOTORS1_1 B=Net=U__5_PartReference_TWO_MOTORS1_1 ENABLE=Net=U6_PartReference_TWO_MOTORS1_DRIVE_6 I=Net=U__7_PartReference_TWO_MOTORS1_1 MODE=Net=U6_PartReference_TWO_MOTORS1_DRIVE_2 nFAULT=Net=R__10_PartReference_TWO_MOTORS1_DRIVE_1 PHASE=Net=U6_PartReference_TWO_MOTORS1_DRIVE_3 SENSE=Net=R__1_PartReference_TWO_MOTORS1_1 SLEEP=Net=R__9_PartReference_TWO_MOTORS1_DRIVE_1

### Notes on the sheet
- RECEPTEUR RS422
- (in symbol LMV821DCKT) -; +
- (in symbol TitleBlock HEIG-VD) Ecole d'Ingénierie et de Gestion du Canton de Vaud; rte de Cheseaux, 1; CH-1401 Yverdon-les-Bains; T +41(0)24 55 76 330; F +41(0)24 55 76 320; U http://www.heig-vd.ch; M iai@heig-vd.ch; Titre; Papier; Projet; No.; SVN; Version; Localisation:; Date:; Page:; sur; Auteur:

### Library data of the parts
* = TitleBlock HEIG-VD: as *#1 on sheet 2; Page Create Date: March  8, 1995; No Projet: -; Location: https://robot.heig-vd.ch/svn/; Page Modify Date: *; Page_Number: =TitleBlock_3_Page_Number
=C__13_PartReference =C__17_PartReference = C_Dup1: as =C__1_PartReference on sheet 5; Distributeur: Farnell; Ref. Distributeur: 432210; Distributor: Farnell; Price in €: 0.140; Ref. Distributor: 499-687
=C__14_PartReference = C_Dup1: Ref. Fabricant: AVX; Prix: 0.36; Ref. Fab: AVXMCCTA106M006.MULTICOMP; VOLTAGE: 10V; Référence: 757-720; Designation: Tantale standard; Prix Unitaire: 0.40; fab: B45196-E2225K109; PCB Footprint: HEIG/SM/C_0805; Distributeur: Farnell; Ref. Distributeur: 498660; Price in €: 0.87; Ref. Distributor: 967-014; Distributor: Farnell
=C__15_PartReference = C_Dup1: as =C__5_PartReference on sheet 5; Distributor: Farnell; Ref. Distributor: 967-014; Price in €: 0.87; Ref. Distributeur: 498660; Distributeur: Farnell
=C__16_PartReference =C__20_PartReference = C_Dup1: as =C__2_PartReference on sheet 5; Ref. Distributor: 499-687; Price in €: 0.140; Distributor: Farnell; Ref. Distributeur: 432210; Distributeur: Farnell
=R__4_PartReference =R__7_PartReference = R_Dup3: as =R__1_PartReference on sheet 5; Distributeur: Farnell
  =R__4_PartReference: Ref. Distributeur: 9331751
  =R__7_PartReference: Ref. Distributeur: 9332154
=R__5_PartReference = R_Dup3: Ref. Fabricant: MULTICOMP; Prix: 0.028; PCB Footprint: HEIG/SM/R_1206; Distributeur: Farnell; Ref. Distributeur: 9332154
=R__6_PartReference =R__8_PartReference =R__9_PartReference =R__10_PartReference = R_Dup3: Prix: 0.028; Ref. Fabricant: MULTICOMP; PCB Footprint: HEIG/SM/R_0805; Distributeur: Farnell
  =R__6_PartReference =R__8_PartReference: Ref. Distributeur: 9331751
  =R__9_PartReference =R__10_PartReference: Ref. Distributeur: 9332154
=U__8_PartReference = AM26LS32_1: Quantité min: 1; Fabricant: TEXAS INSTRUMENTS; Prix: 0.59; Ref. Fabricant: TI; Ref. Distributor: 1103045; Ref. Distributeur: 1103045; Distributeur: Farnell; PCB Footprint: HEIG/SM/SOIC16
=X__PartReference = Connecteur 10: Ref. Fab: 2-5499141-4; Ref. Fabricant: 1-828584-0; Prix: 0.94; Ref. Distributor: 1107899; Distributeur: Farnell; Ref. Distributeur: 1187838; PCB Footprint: HEIG/CONN/HE10/10
=U6_PartReference = A3950: PCB Footprint: HEIG/SM/TSSOP16
=U__9_PartReference = LMV821DCKT: PCB Footprint: HEIG/SM/SC70